# EAGLE schematic PXF_v2.0 (EAGLE 7.1.0)

## Sheet 1 of 9
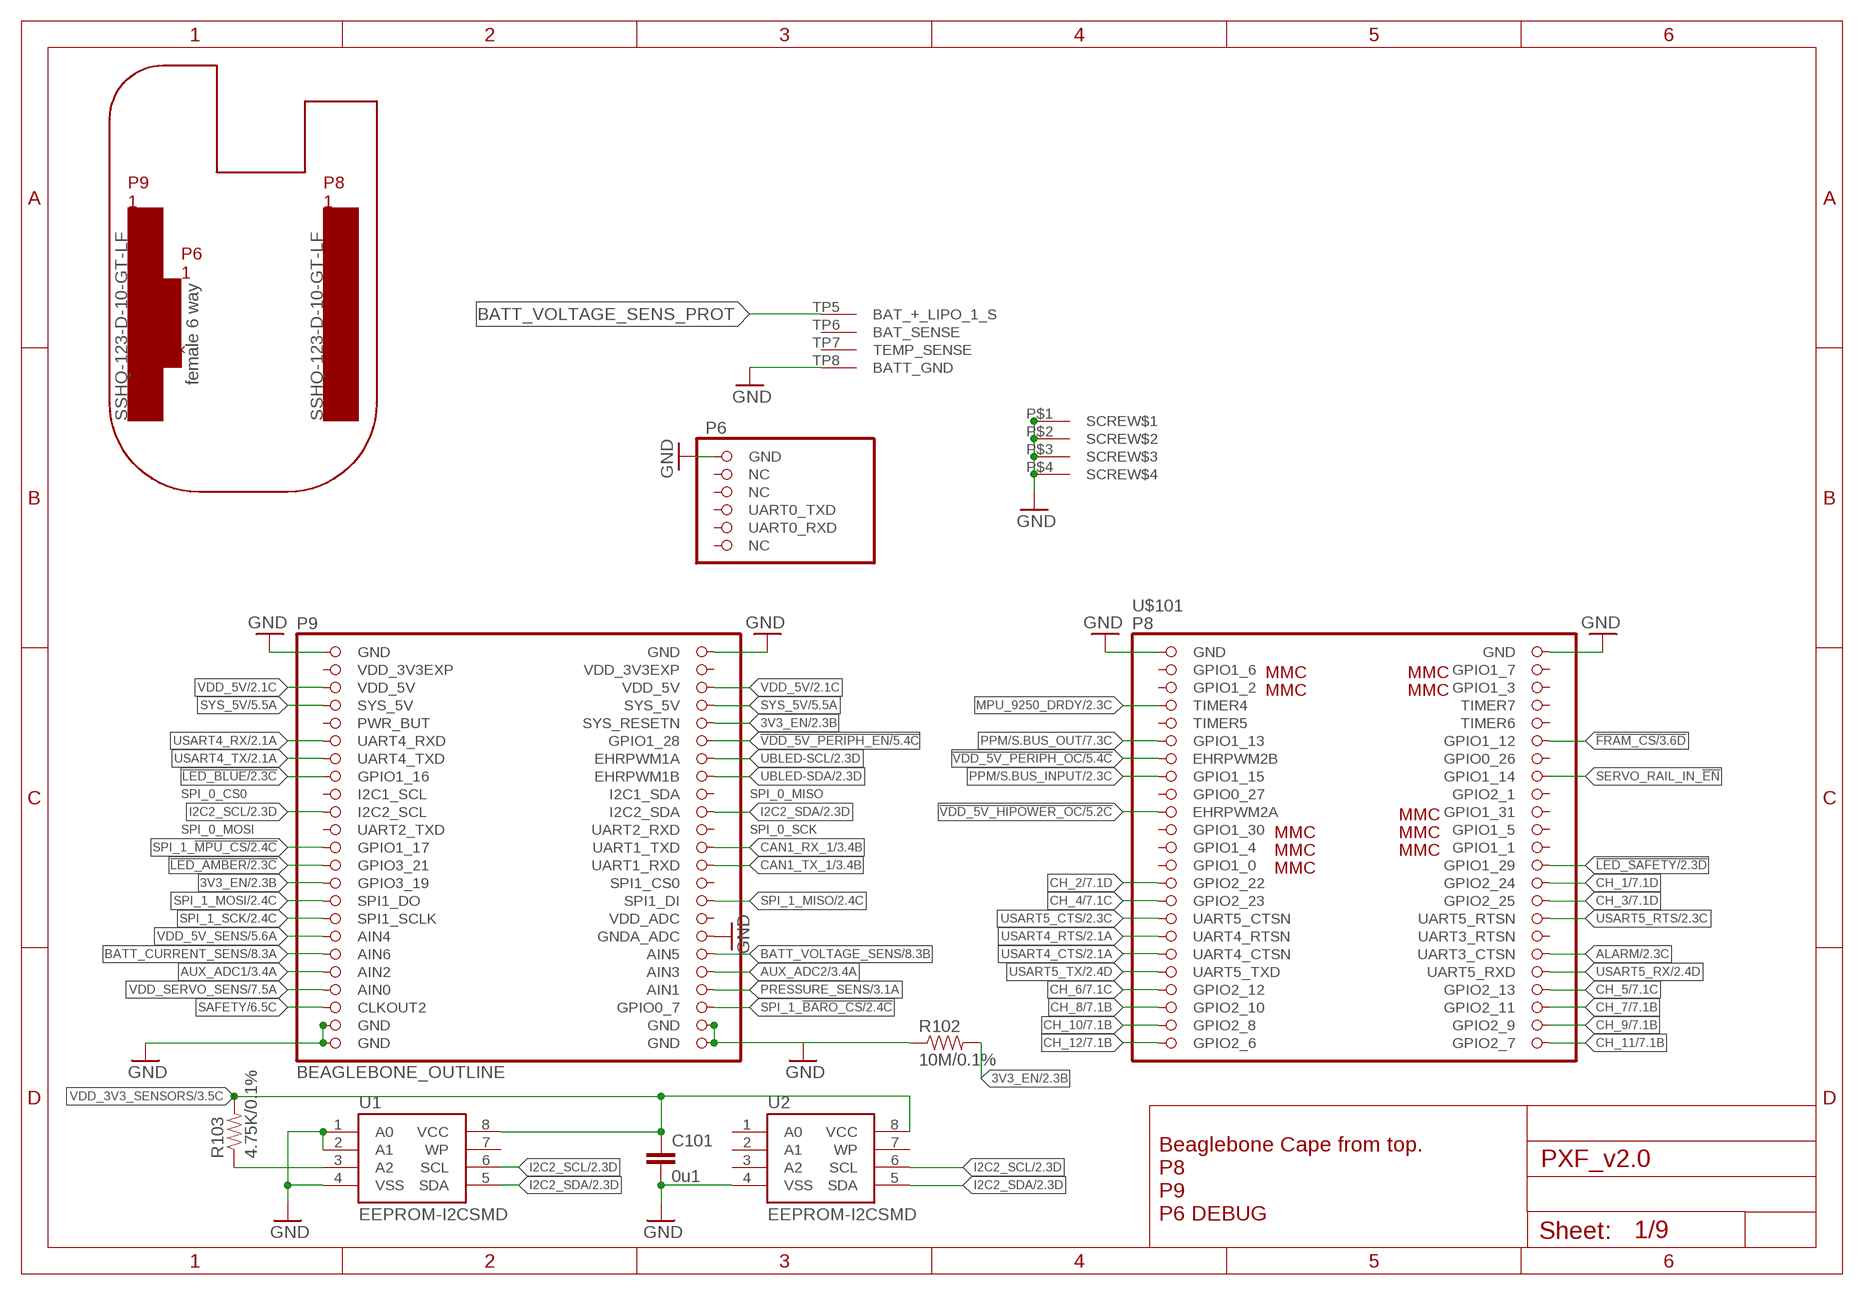
[diagram p0: schematic, sheet 1]
U$16 (NOT-CONNECTED): PARTNO: SSHQ-123-D-10-GT-LF
U$17 (NOT-CONNECTED): PARTNO: SSHQ-123-D-10-GT-LF
U$18 (NOT-CONNECTED): PARTNO: female 6 way

### Parts
C101  0u1  CAP0402  [0402-CAP]
R102  10M/0.1%  RESISTOR0402-RES  [0402-RES]
R103  4.75K/0.1%  RESISTOR0402-RES  [0402-RES]
U1  EEPROM-I2CSMD  [SO08]
U2  EEPROM-I2CSMD  [SO08]
U$101  BEAGLEBONE_OUTLINE  [BEAGLEBONE_SHIELD]

### Nets
3V3_EN [power]: R102.P$2 U$101.56(SYS_RESETN) U$101.73(GPIO3_19) ; also sheet 2,5
!FRAM_CS: U$101.12(GPIO1_12) ; also sheet 3
!LED_AMBER: U$101.71(GPIO3_21) ; also sheet 2,6
!LED_BLUE: U$101.61(GPIO1_16) ; also sheet 2,6
!LED_SAFETY: U$101.26(GPIO1_29) ; also sheet 2,6
!VDD_5V_HIPOWER_OC: U$101.19(EHRPWM2A) ; also sheet 5
!VDD_5V_PERIPH_EN: U$101.58(GPIO1_28) ; also sheet 5
!VDD_5V_PERIPH_OC: U$101.13(EHRPWM2B) ; also sheet 5
ALARM: U$101.36(UART3_CTSN) ; also sheet 2,6
AUX_ADC1: U$101.83(AIN2) ; also sheet 3,4
AUX_ADC2: U$101.84(AIN3) ; also sheet 3,4
BATT_CURRENT_SENS: U$101.81(AIN6) ; also sheet 8
BATT_VOLTAGE_SENS: U$101.82(AIN5) ; also sheet 8
BATT_VOLTAGE_SENS_PROT: U$101.TP5(BAT_+_LIPO_1_S) ; also sheet 8
CAN1_RX_1: U$101.70(UART1_TXD) ; also sheet 3
CAN1_TX_1: U$101.72(UART1_RXD) ; also sheet 3
CH_1: U$101.28(GPIO2_24) ; also sheet 7
CH_2: U$101.27(GPIO2_22) ; also sheet 7
CH_3: U$101.30(GPIO2_25) ; also sheet 7
CH_4: U$101.29(GPIO2_23) ; also sheet 7
CH_5: U$101.40(GPIO2_13) ; also sheet 7
CH_6: U$101.39(GPIO2_12) ; also sheet 7
CH_7: U$101.42(GPIO2_11) ; also sheet 7
CH_8: U$101.41(GPIO2_10) ; also sheet 7
CH_9: U$101.44(GPIO2_9) ; also sheet 7
CH_10: U$101.43(GPIO2_8) ; also sheet 7
CH_11: U$101.46(GPIO2_7) ; also sheet 7
CH_12: U$101.45(GPIO2_6) ; also sheet 7
GND [power]: C101.P$2 R102.P$1 U1.1(A0) U1.2(A1) U1.4(VSS) U2.4(VSS) U$101.1(GND) U$101.2(GND) U$101.47(GND) U$101.48(GND) U$101.80(GNDA_ADC) U$101.89(GND) U$101.90(GND) U$101.91(GND) U$101.92(GND) U$101.93(GND) U$101.P$1(SCREW$1) U$101.P$2(SCREW$2) U$101.P$3(SCREW$3) U$101.P$4(SCREW$4) U$101.TP8(BATT_GND) ; also sheet 2,3,4,5,6,7,8,9
I2C2_SCL: U1.6(SCL) U2.6(SCL) U$101.65(I2C2_SCL) ; also sheet 2,3,4,7
I2C2_SDA: U1.5(SDA) U2.5(SDA) U$101.66(I2C2_SDA) ; also sheet 2,3,4,7
MPU_9250_DRDY: U$101.7(TIMER4) ; also sheet 2,4
N$43: R103.P$1 U1.3(A2)
PPM/S.BUS_INPUT: U$101.15(GPIO1_15) ; also sheet 2,7,9
PPM/S.BUS_OUT: U$101.11(GPIO1_13) ; also sheet 7
PRESSURE_SENS: U$101.86(AIN1) ; also sheet 3
SAFETY: U$101.87(CLKOUT2) ; also sheet 6
SERVO_RAIL_IN_!EN: U$101.16(GPIO1_14)
SPI_1_!BARO_CS: U$101.88(GPIO0_7) ; also sheet 2,4
SPI_1_!MPU_CS: U$101.69(GPIO1_17) ; also sheet 2,4
SPI_1_MISO: U$101.76(SPI1_DI) ; also sheet 2,3,4
SPI_1_MOSI: U$101.75(SPI1_DO) ; also sheet 2,3,4
SPI_1_SCK: U$101.77(SPI1_SCLK) ; also sheet 2,3,4
SYS_5V: U$101.53(SYS_5V) U$101.54(SYS_5V) ; also sheet 5,7,8,9
UBLED-SCL: U$101.60(EHRPWM1A) ; also sheet 2,3
UBLED-SDA: U$101.62(EHRPWM1B) ; also sheet 2,3
USART4_CTS: U$101.35(UART4_CTSN) ; also sheet 2
USART4_RTS: U$101.33(UART4_RTSN) ; also sheet 2
USART4_RX: U$101.57(UART4_RXD) ; also sheet 2
USART4_TX: U$101.59(UART4_TXD) ; also sheet 2
USART5_CTS: U$101.31(UART5_CTSN) ; also sheet 2
USART5_RTS: U$101.32(UART5_RTSN) ; also sheet 2
USART5_RX: U$101.38(UART5_RXD) ; also sheet 2
USART5_TX: U$101.37(UART5_TXD) ; also sheet 2
VDD_3V3_SENSORS [power]: C101.P$1 R103.P$2 U1.8(VCC) U2.8(VCC) ; also sheet 3,4,5,9
VDD_5V [power]: U$101.51(VDD_5V) U$101.52(VDD_5V) ; also sheet 2,8,9
VDD_5V_SENS: U$101.79(AIN4) ; also sheet 5
VDD_SERVO_SENS: U$101.85(AIN0) ; also sheet 7
Unconnected: U1.7(WP) U2.1(A0) U2.2(A1) U2.3(A2) U2.7(WP) U$101.3(GPIO1_6) U$101.4(GPIO1_7) U$101.5(GPIO1_2) U$101.6(GPIO1_3) U$101.8(TIMER7) U$101.9(TIMER5) U$101.10(TIMER6) U$101.14(GPIO0_26) U$101.17(GPIO0_27) U$101.18(GPIO2_1) U$101.20(GPIO1_31) U$101.21(GPIO1_30) U$101.22(GPIO1_5) U$101.23(GPIO1_4) U$101.24(GPIO1_1) U$101.25(GPIO1_0) U$101.34(UART3_RTSN) U$101.55(PWR_BUT) U$101.63(I2C1_SCL) U$101.64(I2C1_SDA) U$101.67(UART2_TXD) U$101.68(UART2_RXD) U$101.74(SPI1_CS0) U$101.78(VDD_ADC) U$101.94(NC) U$101.95(NC) U$101.96(UART0_TXD) U$101.97(UART0_RXD) U$101.98(NC) U$101.TP6(BAT_SENSE) U$101.TP7(TEMP_SENSE)

### Notes on the sheet
- SPI_0_CS0 | SPI_0_MISO
- SPI_0_MOSI | SPI_0_SCK
- Beaglebone Cape from top.
  P8
  P9
  P6 DEBUG

## Sheet 2 of 9
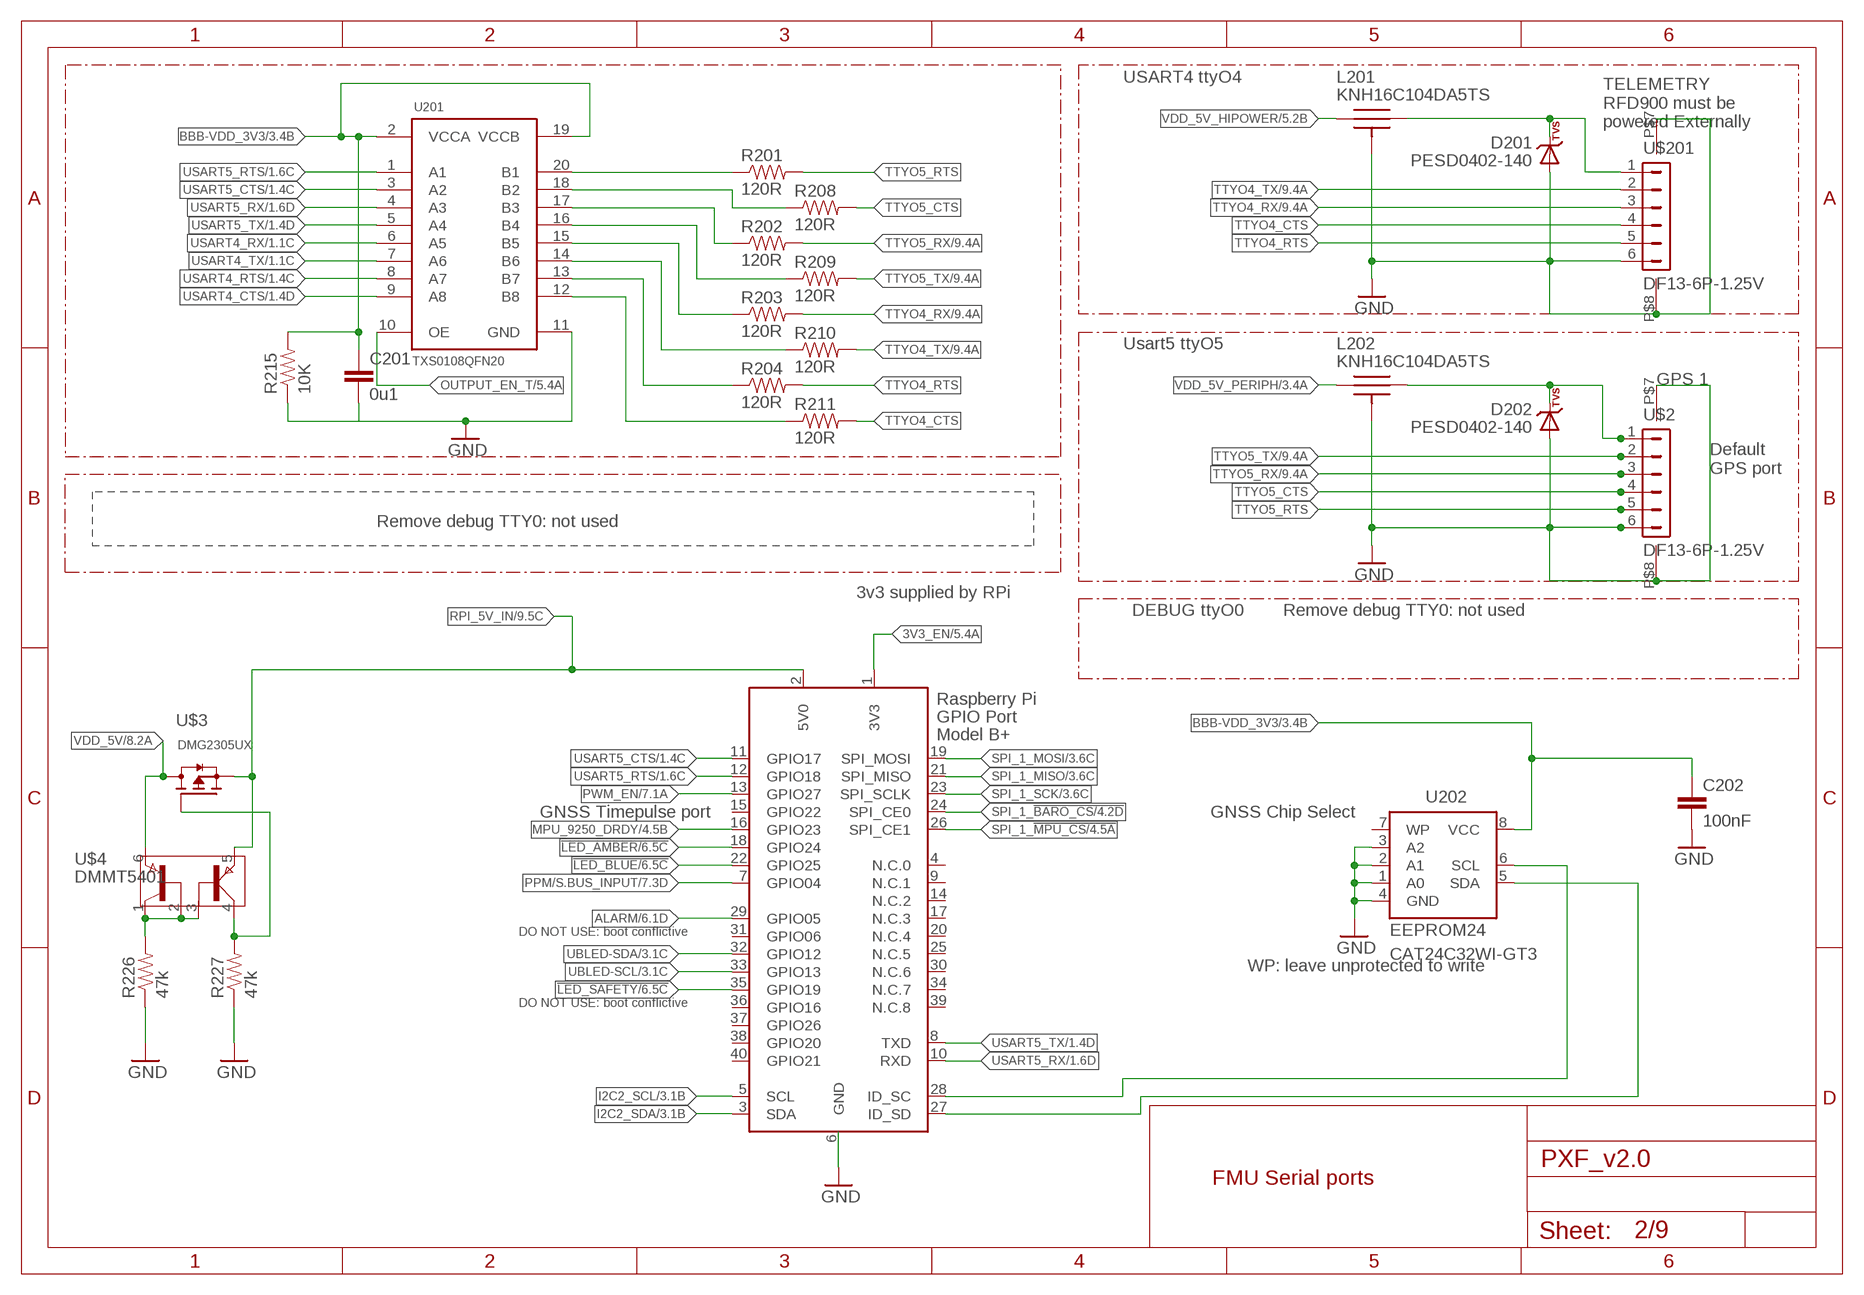
[diagram p1: schematic, sheet 2]

### Parts
C201  0u1  CAP0402  [0402-CAP]
C202  100nF  CAP0402  [0402-CAP]
D201  PESD0402-140  DIODE-TVS  [0402-TVS]
D202  PESD0402-140  DIODE-TVS  [0402-TVS]
L201  KNH16C104DA5TS  [KYOCERA-KNH16-DA]
L202  KNH16C104DA5TS  [KYOCERA-KNH16-DA]
R201  120R  RESISTOR0402-RES  [0402-RES]
R202  120R  RESISTOR0402-RES  [0402-RES]
R203  120R  RESISTOR0402-RES  [0402-RES]
R204  120R  RESISTOR0402-RES  [0402-RES]
R208  120R  RESISTOR0402-RES  [0402-RES]
R209  120R  RESISTOR0402-RES  [0402-RES]
R210  120R  RESISTOR0402-RES  [0402-RES]
R211  120R  RESISTOR0402-RES  [0402-RES]
R215  10K  RESISTOR0402-RES  [0402-RES]
R226  47k  RESISTOR0402-RES  [0402-RES]
R227  47k  RESISTOR0402-RES  [0402-RES]
U201  TXS0108QFN20  [QFN20-RGY]
U202  EEPROM24  [SOIC8]
U$2  DF13-6P-1.25V  [DF13C-6P-1.25V]
U$3  P-MOSFET  [SOT23]
U$4  DMMT5401  [SOT26]
U$201  DF13-6P-1.25V  [DF13C-6P-1.25V]
X2  RASPI_BOARD_B+_F  [RASPI_BOARD_B+_FULL]

### Nets
3V3_EN [power]: X2.1(3V3) ; also sheet 1,5
!LED_AMBER: X2.18(GPIO24) ; also sheet 1,6
!LED_BLUE: X2.22(GPIO25) ; also sheet 1,6
!LED_SAFETY: X2.35(GPIO19) ; also sheet 1,6
ALARM: X2.29(GPIO05) ; also sheet 1,6
BBB-VDD_3V3 [power]: C201.P$1 C202.P$1 R215.P$2 U201.2(VCCA) U201.19(VCCB) U202.8(VCC) ; also sheet 3,5,6,7,9
GND [power]: C201.P$2 C202.P$2 D201.A D202.A L201.P$3 L201.P$4 L201.P$5 L202.P$3 L202.P$4 L202.P$5 R215.P$1 R226.P$1 R227.P$1 U201.11(GND) U202.1(A0) U202.2(A1) U202.3(A2) U202.4(GND) U$2.6 U$2.P$7 U$2.P$8 U$201.6 U$201.P$7 U$201.P$8 ; also sheet 1,3,4,5,6,7,8,9
I2C2_SCL: X2.5(SCL) ; also sheet 1,3,4,7
I2C2_SDA: X2.3(SDA) ; also sheet 1,3,4,7
MPU_9250_DRDY: X2.16(GPIO23) ; also sheet 1,4
N$1: U202.6(SCL) X2.28(ID_SC)
N$3: U202.5(SDA) X2.27(ID_SD)
N$5 [power]: D201.C L201.P$2 U$201.1
N$7: R226.P$2 U$4.1 U$4.2 U$4.3
N$8: R227.P$2 U$3.G U$4.4
N$49: R208.P$1 U201.18(B2)
N$53: R201.P$1 U201.20(B1)
N$83: R202.P$1 U201.17(B3)
N$84: R209.P$1 U201.16(B4)
N$85: R203.P$1 U201.15(B5)
N$86: R210.P$1 U201.14(B6)
N$87: R204.P$1 U201.13(B7)
N$88: R211.P$1 U201.12(B8)
N$101 [power]: D202.C L202.P$2 U$2.1
OUTPUT_EN_T: U201.10(OE) ; also sheet 5
PPM/S.BUS_INPUT: X2.7(GPIO04) ; also sheet 1,7,9
PWM_EN: X2.13(GPIO27) ; also sheet 7,9
RPI_5V_IN: U$3.S U$4.5 X2.2(5V0) ; also sheet 9
SPI_1_!BARO_CS: X2.24(SPI_CE0) ; also sheet 1,4
SPI_1_!MPU_CS: X2.26(SPI_CE1) ; also sheet 1,4
SPI_1_MISO: X2.21(SPI_MISO) ; also sheet 1,3,4
SPI_1_MOSI: X2.19(SPI_MOSI) ; also sheet 1,3,4
SPI_1_SCK: X2.23(SPI_SCLK) ; also sheet 1,3,4
TTYO4_CTS: R211.P$2 U$201.4
TTYO4_RTS: R204.P$2 U$201.5
TTYO4_RX: R203.P$2 U$201.3 ; also sheet 9
TTYO4_TX: R210.P$2 U$201.2 ; also sheet 9
TTYO5_CTS: R208.P$2 U$2.4
TTYO5_RTS: R201.P$2 U$2.5
TTYO5_RX: R202.P$2 U$2.3 ; also sheet 9
TTYO5_TX: R209.P$2 U$2.2 ; also sheet 9
UBLED-SCL: X2.33(GPIO13) ; also sheet 1,3
UBLED-SDA: X2.32(GPIO12) ; also sheet 1,3
USART4_CTS: U201.9(A8) ; also sheet 1
USART4_RTS: U201.8(A7) ; also sheet 1
USART4_RX: U201.6(A5) ; also sheet 1
USART4_TX: U201.7(A6) ; also sheet 1
USART5_CTS: U201.3(A2) X2.11(GPIO17) ; also sheet 1
USART5_RTS: U201.1(A1) X2.12(GPIO18) ; also sheet 1
USART5_RX: U201.4(A3) X2.10(RXD) ; also sheet 1
USART5_TX: U201.5(A4) X2.8(TXD) ; also sheet 1
VDD_5V [power]: U$3.D U$4.6 ; also sheet 1,8,9
VDD_5V_HIPOWER [power]: L201.P$1 ; also sheet 5
VDD_5V_PERIPH [power]: L202.P$1 ; also sheet 3,5,6
Unconnected: U202.7(WP) X2.4(N.C.0) X2.9(N.C.1) X2.14(N.C.2) X2.15(GPIO22) X2.17(N.C.3) X2.20(N.C.4) X2.25(N.C.5) X2.30(N.C.6) X2.31(GPIO06) X2.34(N.C.7) X2.36(GPIO16) X2.37(GPIO26) X2.38(GPIO20) X2.39(N.C.8) X2.40(GPIO21)

### Notes on the sheet
- USART4 ttyO4
- TELEMETRY
  RFD900 must be
  powered Externally
- Usart5 ttyO5
- GPS 1
- Default 
  GPS port
- Remove debug TTY0: not used
- 3v3 supplied by RPi
- DEBUG ttyO0 | Remove debug TTY0: not used
- GNSS Timepulse port | GNSS Chip Select
- DO NOT USE: boot conflictive
- CAT24C32WI-GT3
- WP: leave unprotected to write
- DO NOT USE: boot conflictive
- FMU Serial ports

## Sheet 3 of 9
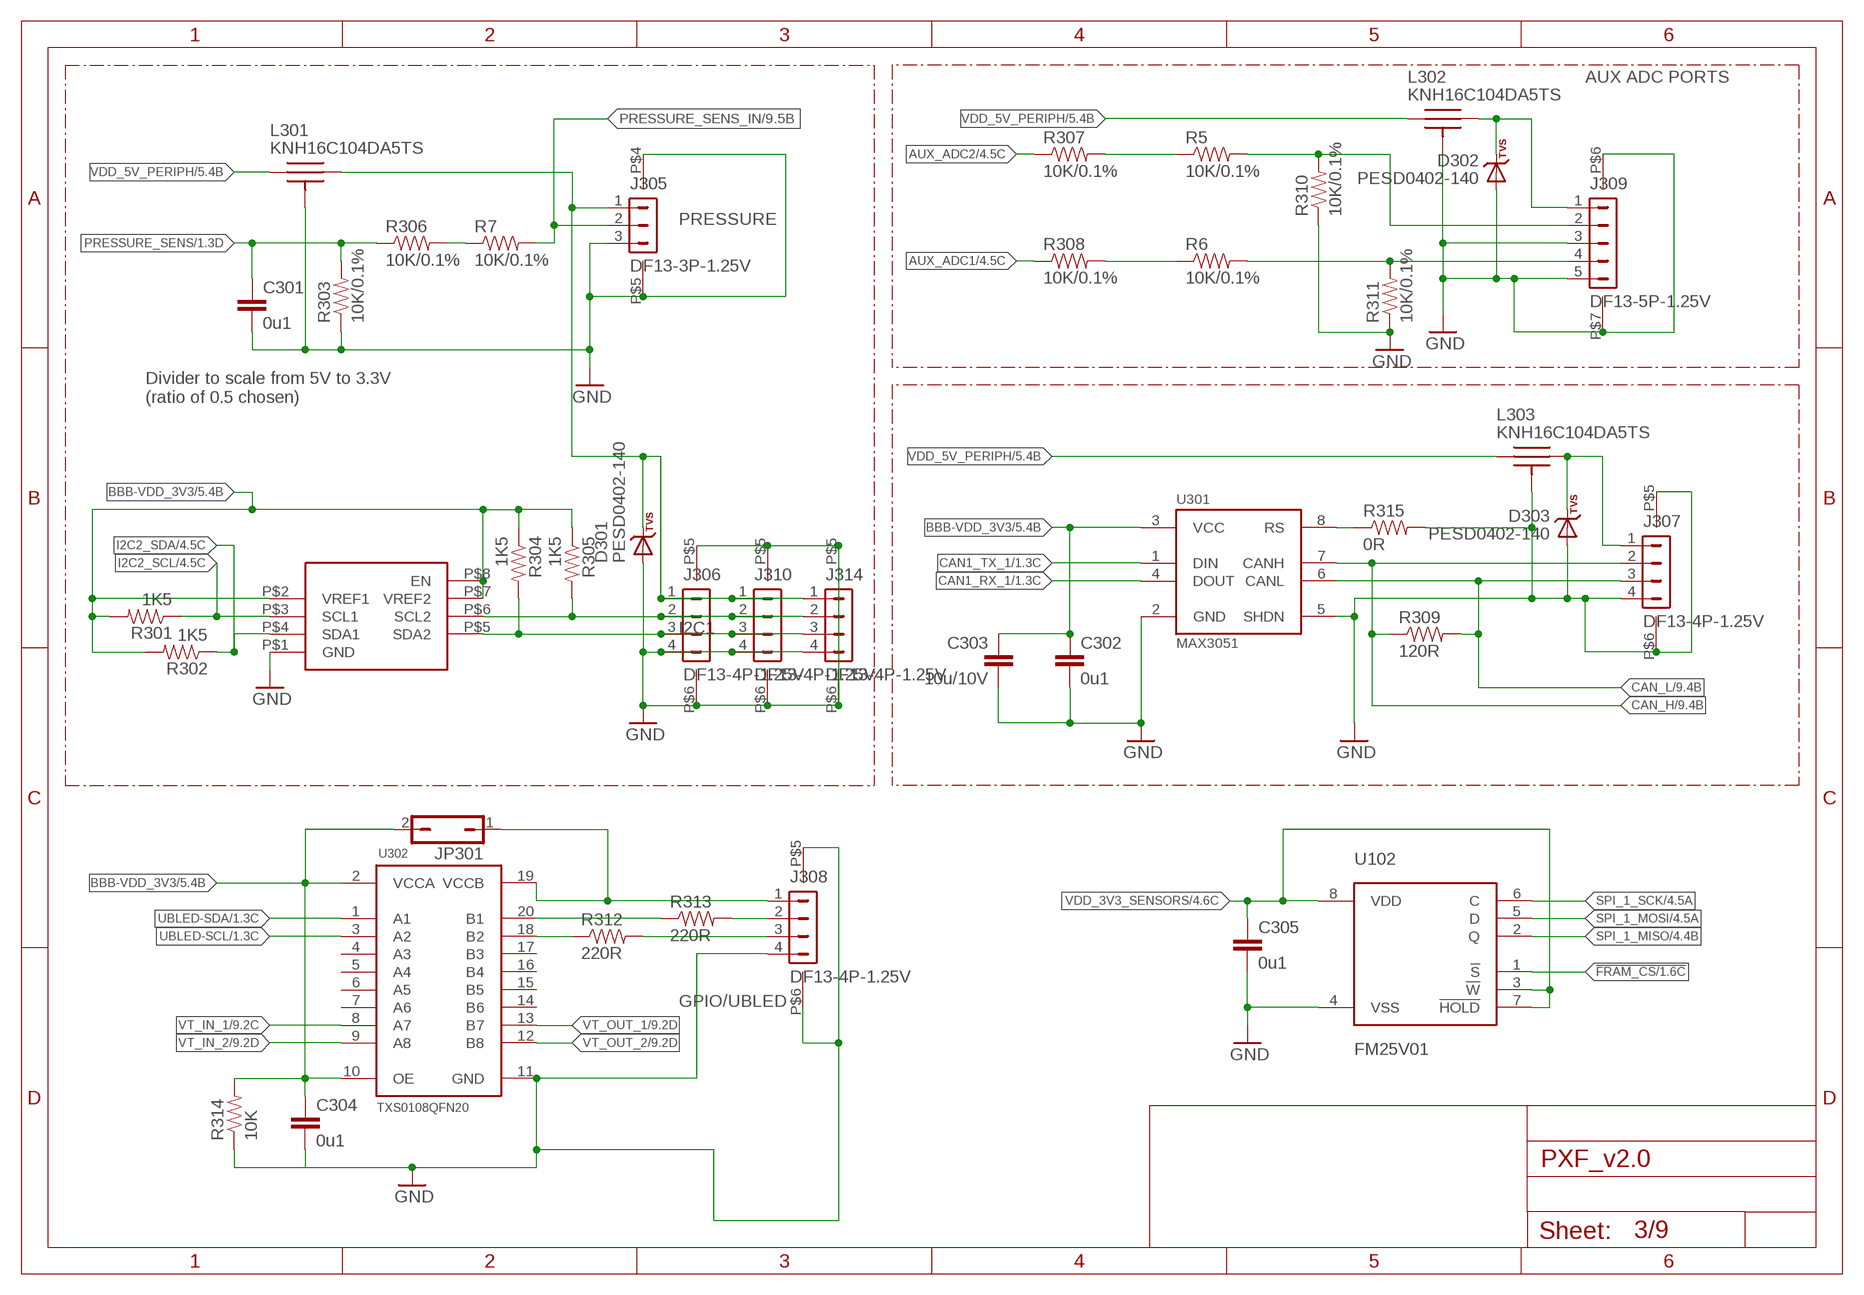
[diagram p2: schematic, sheet 3]

### Parts
C301  0u1  CAP0402  [0402-CAP]
C302  0u1  CAP0402  [0402-CAP]
C303  10u/10V  CAP0805  [0805-CAP]
C304  0u1  CAP0402  [0402-CAP]
C305  0u1  CAP0402  [0402-CAP]
D301  PESD0402-140  DIODE-TVS  [0402-TVS]
D302  PESD0402-140  DIODE-TVS  [0402-TVS]
D303  PESD0402-140  DIODE-TVS  [0402-TVS]
J305  DF13-3P-1.25V  [DF13C-3P-1.25V]
J306  DF13-4P-1.25V  [DF13C-4P-1.25V]
J307  DF13-4P-1.25V  [DF13C-4P-1.25V]
J308  DF13-4P-1.25V  [DF13C-4P-1.25V]
J309  DF13-5P-1.25V  [DF13C-5P-1.25V]
J310  DF13-4P-1.25V  [DF13C-4P-1.25V]
J314  DF13-4P-1.25V  [DF13C-4P-1.25V]
JP301  JP1Q  [JP1]
L301  KNH16C104DA5TS  [KYOCERA-KNH16-DA]
L302  KNH16C104DA5TS  [KYOCERA-KNH16-DA]
L303  KNH16C104DA5TS  [KYOCERA-KNH16-DA]
R5  10K/0.1%  RESISTOR0402-RES  [0402-RES]
R6  10K/0.1%  RESISTOR0402-RES  [0402-RES]
R7  10K/0.1%  RESISTOR0402-RES  [0402-RES]
R301  1K5  RESISTOR0402-RES  [0402-RES]
R302  1K5  RESISTOR0402-RES  [0402-RES]
R303  10K/0.1%  RESISTOR0402-RES  [0402-RES]
R304  1K5  RESISTOR0402-RES  [0402-RES]
R305  1K5  RESISTOR0402-RES  [0402-RES]
R306  10K/0.1%  RESISTOR0402-RES  [0402-RES]
R307  10K/0.1%  RESISTOR0402-RES  [0402-RES]
R308  10K/0.1%  RESISTOR0402-RES  [0402-RES]
R309  120R  RESISTOR0402-RES  [0402-RES]
R310  10K/0.1%  RESISTOR0402-RES  [0402-RES]
R311  10K/0.1%  RESISTOR0402-RES  [0402-RES]
R312  220R  RESISTOR0402-RES  [0402-RES]
R313  220R  RESISTOR0402-RES  [0402-RES]
R314  10K  RESISTOR0402-RES  [0402-RES]
R315  0R  RESISTOR0402-RES  [0402-RES]
U102  FM25V01  [SO08]
U301  MAX3051  MAX3051MAX3051EKA  [SOT23-8]
U302  TXS0108QFN20  [QFN20-RGY]
U304  PCA9603  [DCT]

### Nets
!FRAM_CS: U102.1(!S) ; also sheet 1
AUX_ADC1: R308.P$1 ; also sheet 1,4
AUX_ADC2: R307.P$1 ; also sheet 1,4
BBB-VDD_3V3 [power]: C302.P$1 C303.P$1 C304.P$1 JP301.2 R301.P$2 R302.P$2 R304.P$1 R305.P$1 R314.P$2 U301.3(VCC) U302.2(VCCA) U302.10(OE) U304.P$2(VREF1) U304.P$7(VREF2) U304.P$8(EN) ; also sheet 2,5,6,7,9
CAN1_RX_1: U301.4(DOUT) ; also sheet 1
CAN1_TX_1: U301.1(DIN) ; also sheet 1
CAN_H: J307.2 R309.P$1 U301.7(CANH) ; also sheet 9
CAN_L: J307.3 R309.P$2 U301.6(CANL) ; also sheet 9
FMU_AUX_ADC1_PROT: J309.4 R6.P$2 R311.P$2
FMU_AUX_ADC2_PROT: J309.2 R5.P$2 R310.P$2
GND [power]: C301.P$2 C302.P$2 C303.P$2 C304.P$2 C305.P$2 D301.A D302.A D303.A J305.3 J305.P$4 J305.P$5 J306.4 J306.P$5 J306.P$6 J307.4 J307.P$5 J307.P$6 J308.4 J308.P$5 J308.P$6 J309.3 J309.5 J309.P$6 J309.P$7 J310.4 J310.P$5 J310.P$6 J314.4 J314.P$5 J314.P$6 L301.P$3 L301.P$4 L301.P$5 L302.P$3 L302.P$4 L302.P$5 L303.P$3 L303.P$4 L303.P$5 R303.P$1 R310.P$1 R311.P$1 R314.P$1 R315.P$2 U102.4(VSS) U301.2(GND) U301.5(SHDN) U302.11(GND) U304.P$1(GND) ; also sheet 1,2,4,5,6,7,8,9
I2C2_SCL: R301.P$1 U304.P$3(SCL1) ; also sheet 1,2,4,7
I2C2_SDA: R302.P$1 U304.P$4(SDA1) ; also sheet 1,2,4,7
N$17: R313.P$1 U302.20(B1)
N$33: J306.2 J310.2 J314.2 R305.P$2 U304.P$6(SCL2)
N$37: J306.3 J310.3 J314.3 R304.P$2 U304.P$5(SDA2)
N$38: R312.P$1 U302.18(B2)
N$42 [power]: D301.C J305.1 J306.1 J310.1 J314.1 L301.P$2
N$44: J308.3 R312.P$2
N$45: J308.2 R313.P$2
N$47: J308.1 JP301.1 U302.19(VCCB)
N$48 [power]: D303.C J307.1 L303.P$2
N$55 [power]: R315.P$1 U301.8(RS)
N$64: R5.P$1 R307.P$2
N$65: R6.P$1 R308.P$2
N$66: R7.P$1 R306.P$2
N$98 [power]: D302.C J309.1 L302.P$2
PRESSURE_SENS: C301.P$1 R303.P$2 R306.P$1 ; also sheet 1
PRESSURE_SENS_IN: J305.2 R7.P$2 ; also sheet 9
SPI_1_MISO: U102.2(Q) ; also sheet 1,2,4
SPI_1_MOSI: U102.5(D) ; also sheet 1,2,4
SPI_1_SCK: U102.6(C) ; also sheet 1,2,4
UBLED-SCL: U302.3(A2) ; also sheet 1,2
UBLED-SDA: U302.1(A1) ; also sheet 1,2
VDD_3V3_SENSORS [power]: C305.P$1 U102.3(!W) U102.7(!HOLD) U102.8(VDD) ; also sheet 1,4,5,9
VDD_5V_PERIPH [power]: L301.P$1 L302.P$1 L303.P$1 ; also sheet 2,5,6
VT_IN_1: U302.8(A7) ; also sheet 9
VT_IN_2: U302.9(A8) ; also sheet 9
VT_OUT_1: U302.13(B7) ; also sheet 9
VT_OUT_2: U302.12(B8) ; also sheet 9
Unconnected: U302.4(A3) U302.5(A4) U302.6(A5) U302.7(A6) U302.14(B6) U302.15(B5) U302.16(B4) U302.17(B3)

### Notes on the sheet
- AUX ADC PORTS
- PRESSURE
- Divider to scale from 5V to 3.3V
  (ratio of 0.5 chosen)
- I2C1
- GPIO/UBLED

## Sheet 4 of 9
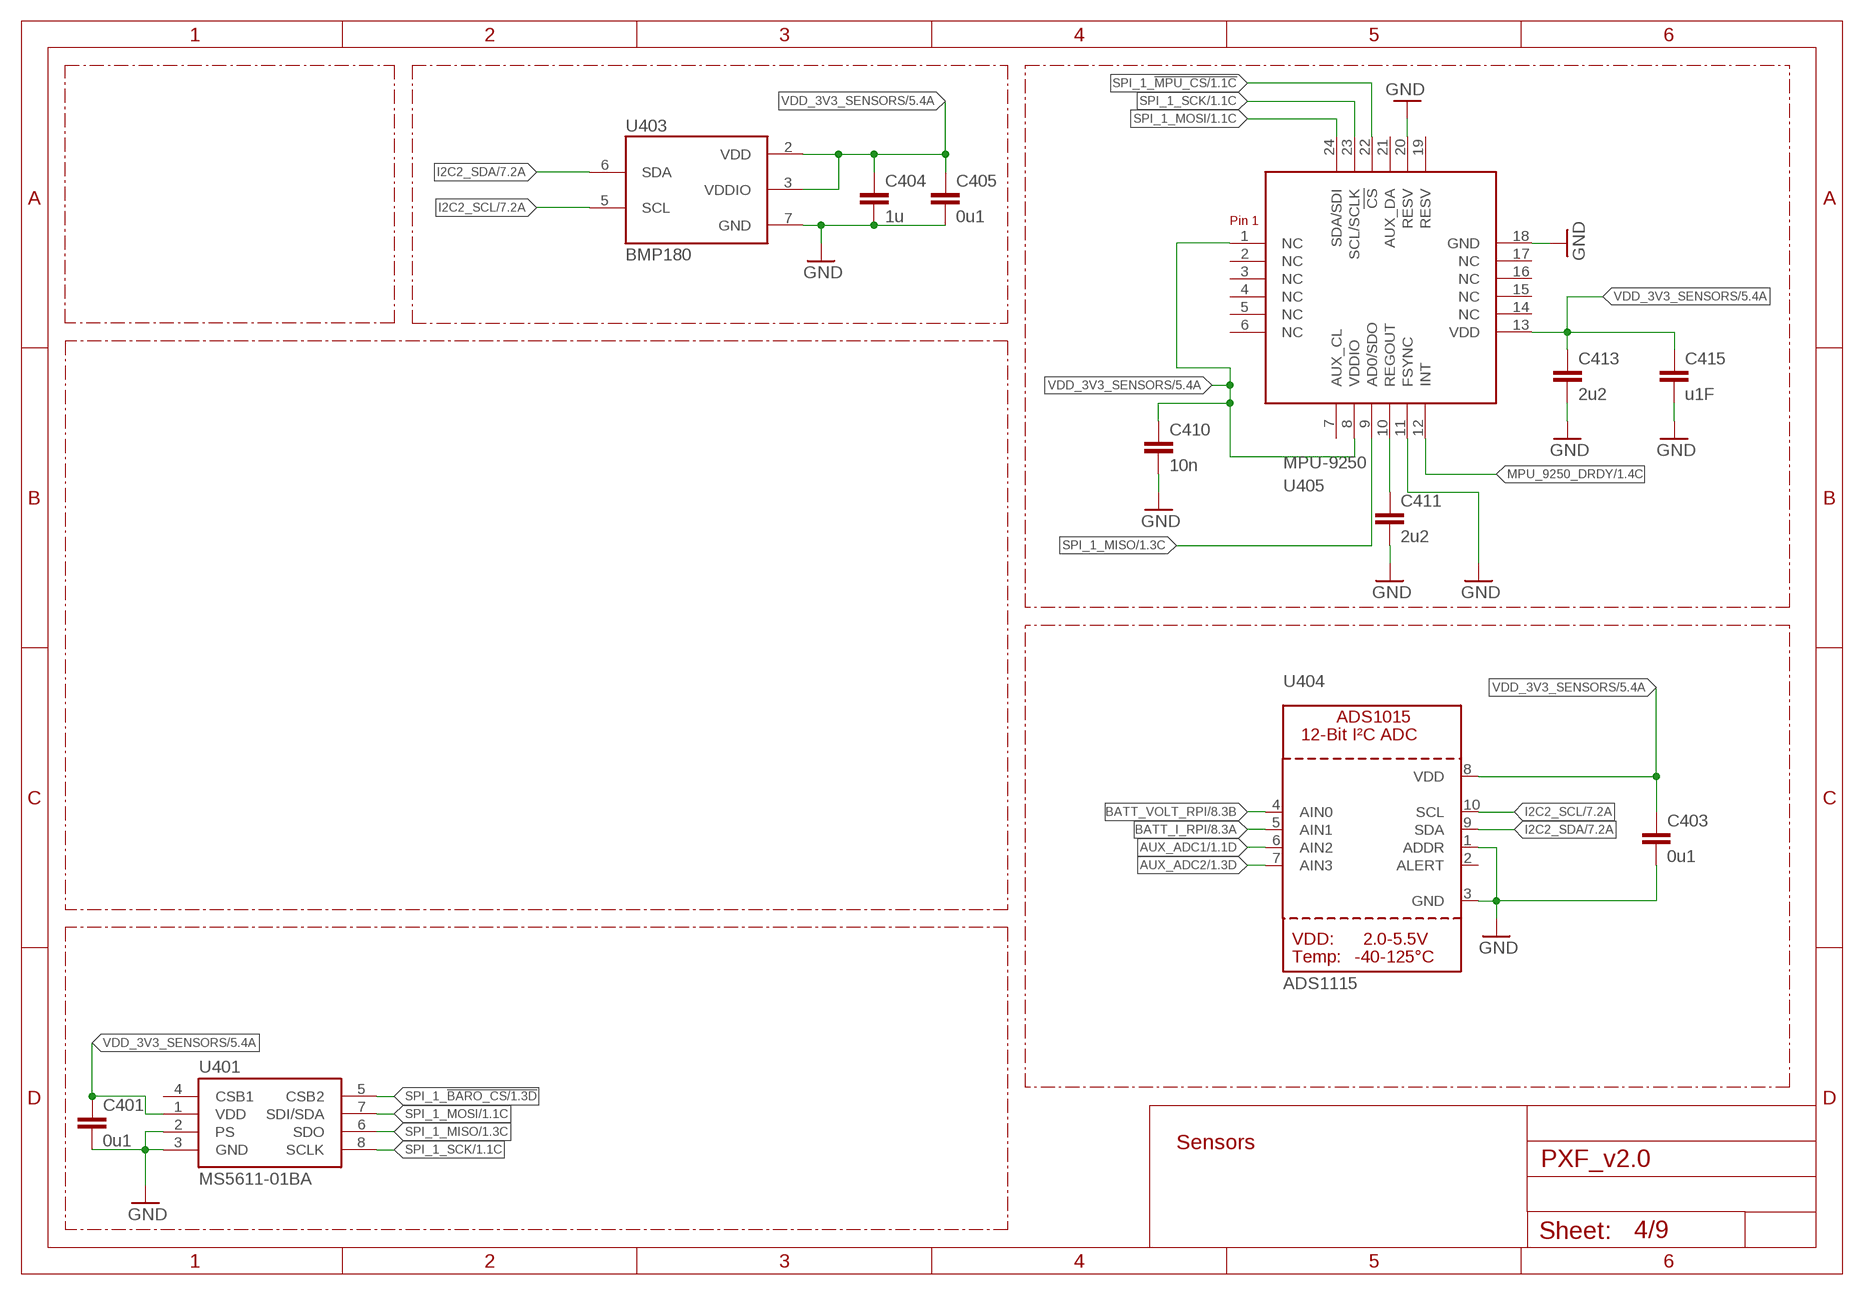
[diagram p3: schematic, sheet 4]

### Parts
C401  0u1  CAP0402  [0402-CAP]
C403  0u1  CAP0402  [0402-CAP]
C404  1u  CAP0402  [0402-CAP]
C405  0u1  CAP0402  [0402-CAP]
C410  10n  CAP0603  [0603-CAP]
C411  2u2  CAP0603  [0603-CAP]
C413  2u2  CAP0603  [0603-CAP]
C415  u1F  CAP0402  [0402-CAP]
U401  MS5611-01BA  [MS5611-01BA]
U403  BMP180  [BMP180]
U404  ADS1115  ADC_ADS1015  [MSOP10]
U405  MPU-9250  MPU-6500  [MPU-6500]

### Nets
AUX_ADC1: U404.6(AIN2) ; also sheet 1,3
AUX_ADC2: U404.7(AIN3) ; also sheet 1,3
BATT_I_RPI: U404.5(AIN1) ; also sheet 8,9
BATT_VOLT_RPI: U404.4(AIN0) ; also sheet 8,9
GND [power]: C401.P$2 C403.P$2 C404.P$2 C405.P$2 C410.P$2 C411.P$2 C413.P$2 C415.P$2 U401.2(PS) U401.3(GND) U403.7(GND) U404.1(ADDR) U404.3(GND) U405.11(FSYNC) U405.18(GND) U405.20(RESV) ; also sheet 1,2,3,5,6,7,8,9
I2C2_SCL: U403.5(SCL) U404.10(SCL) ; also sheet 1,2,3,7
I2C2_SDA: U403.6(SDA) U404.9(SDA) ; also sheet 1,2,3,7
MPU_9250_DRDY: U405.12(INT) ; also sheet 1,2
N$15: C411.P$1 U405.10(REGOUT)
SPI_1_!BARO_CS: U401.5(CSB2) ; also sheet 1,2
SPI_1_!MPU_CS: U405.22(!CS) ; also sheet 1,2
SPI_1_MISO: U401.6(SDO) U405.9(AD0/SDO) ; also sheet 1,2,3
SPI_1_MOSI: U401.7(SDI/SDA) U405.24(SDA/SDI) ; also sheet 1,2,3
SPI_1_SCK: U401.8(SCLK) U405.23(SCL/SCLK) ; also sheet 1,2,3
VDD_3V3_SENSORS [power]: C401.P$1 C403.P$1 C404.P$1 C405.P$1 C410.P$1 C413.P$1 C415.P$1 U401.1(VDD) U403.2(VDD) U403.3(VDDIO) U404.8(VDD) U405.1(NC) U405.8(VDDIO) U405.13(VDD) ; also sheet 1,3,5,9
Unconnected: U401.4(CSB1) U404.2(ALERT) U405.2(NC) U405.3(NC) U405.4(NC) U405.5(NC) U405.6(NC) U405.7(AUX_CL) U405.14(NC) U405.15(NC) U405.16(NC) U405.17(NC) U405.19(RESV) U405.21(AUX_DA)

### Notes on the sheet
- Sensors

## Sheet 5 of 9
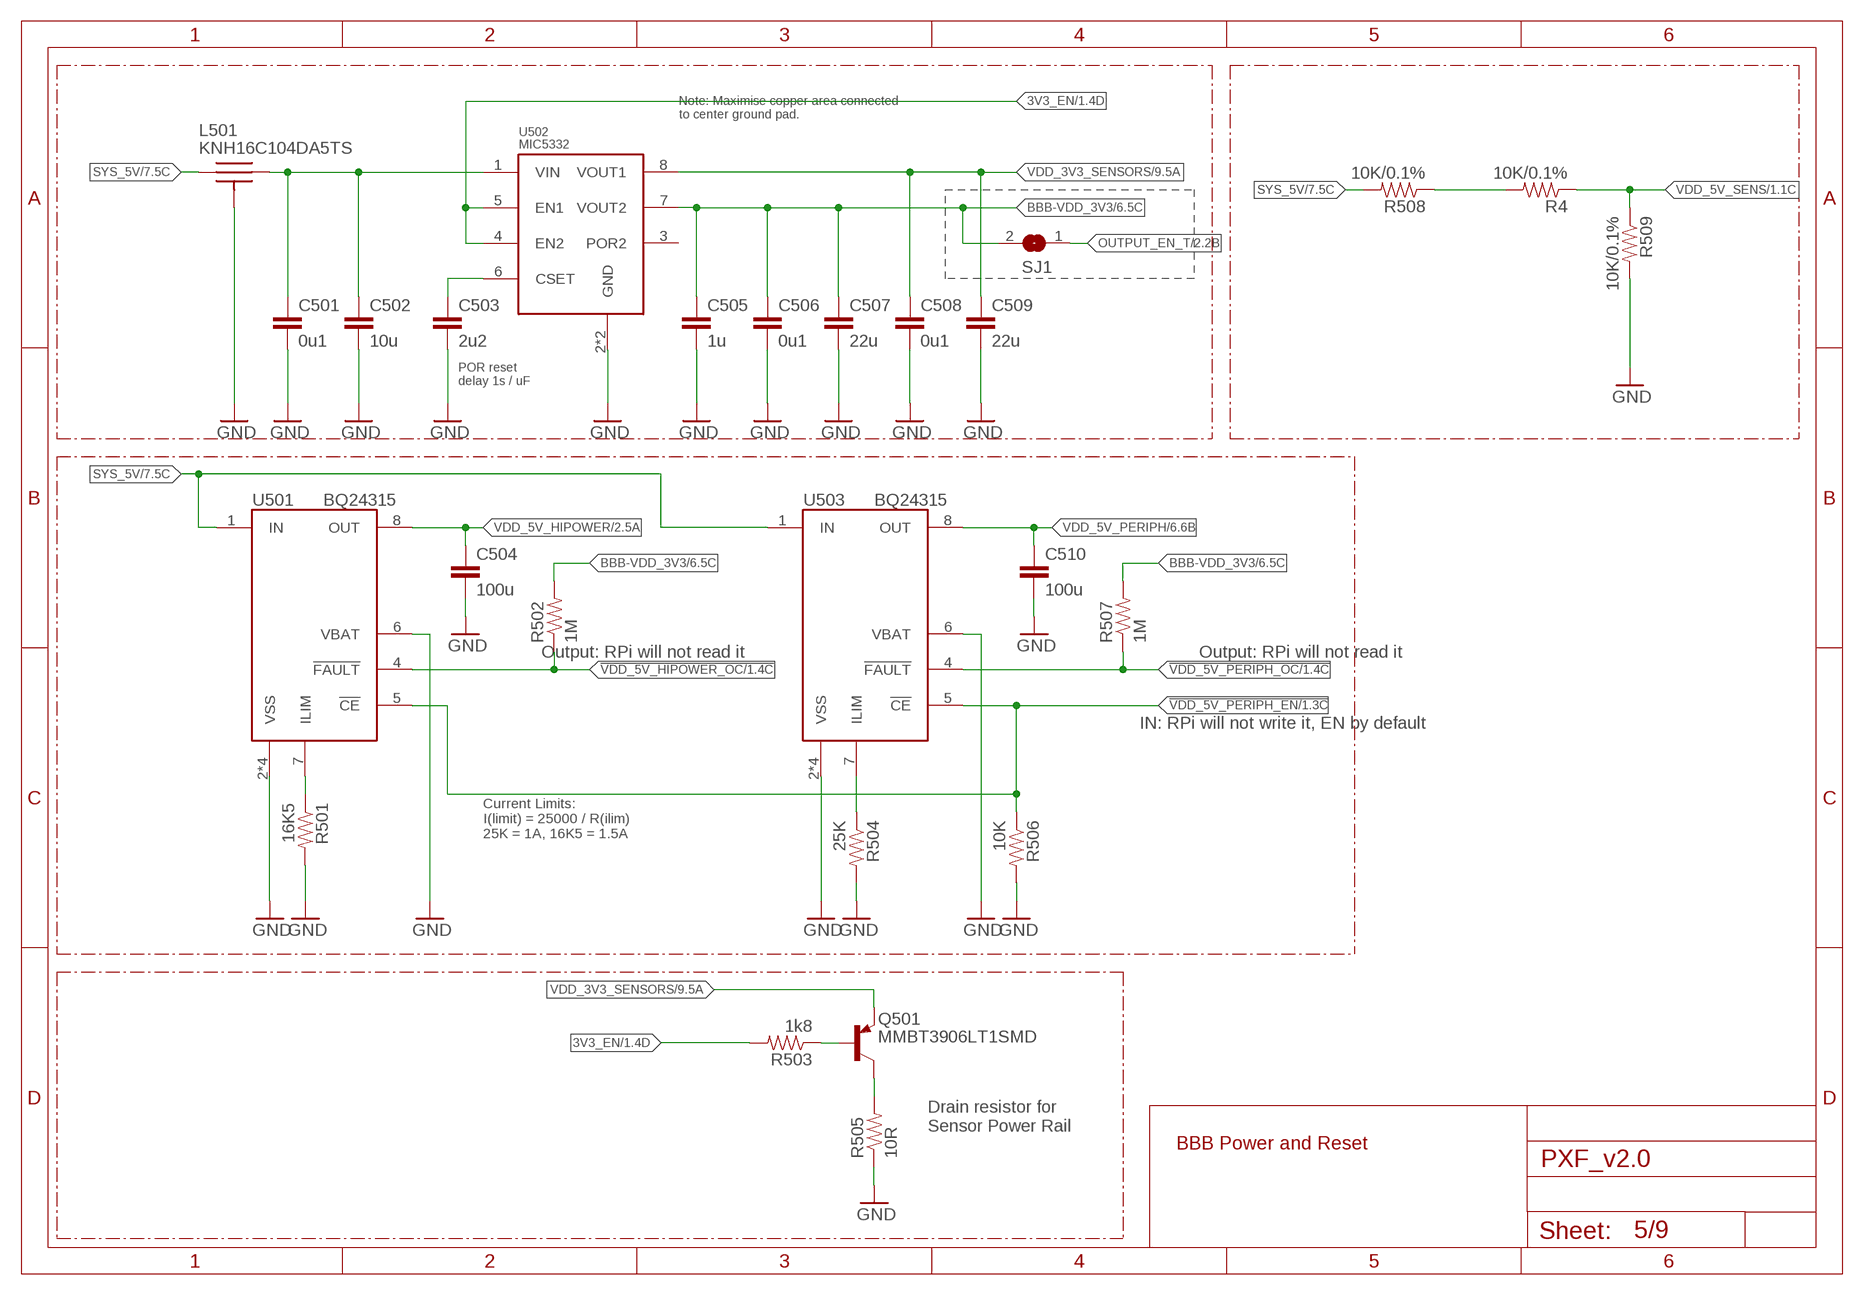
[diagram p4: schematic, sheet 5]

### Parts
C501  0u1  CAP0402  [0402-CAP]
C502  10u  CAP0805  [0805-CAP]
C503  2u2  CAP0603  [0603-CAP]
C504  100u  CAP1206  [1206-CAP]
C505  1u  CAP0603  [0603-CAP]
C506  0u1  CAP0402  [0402-CAP]
C507  22u  CAP0805  [0805-CAP]
C508  0u1  CAP0402  [0402-CAP]
C509  22u  CAP0805  [0805-CAP]
C510  100u  CAP1206  [1206-CAP]
L501  KNH16C104DA5TS  [KYOCERA-KNH16-DA]
Q501  MMBT3906LT1SMD  [SOT23-BEC]
R4  10K/0.1%  RESISTOR0402-RES  [0402-RES]
R501  16K5  RESISTOR0402-RES  [0402-RES]
R502  1M  RESISTOR0402-RES  [0402-RES]
R503  1k8  RESISTOR0402-RES  [0402-RES]
R504  25K  RESISTOR0402-RES  [0402-RES]
R505  10R  RESISTOR0603-RES  [0603-RES]
R506  10K  RESISTOR0402-RES  [0402-RES]
R507  1M  RESISTOR0402-RES  [0402-RES]
R508  10K/0.1%  RESISTOR0402-RES  [0402-RES]
R509  10K/0.1%  RESISTOR0402-RES  [0402-RES]
SJ1  SOLDERJUMPERCLOSED  [SOLDERJUMPER_CLOSEDWIRE]
U501  BQ24315  [QFN8-DSG]
U502  MIC5332  [MLF-8-EPAD]
U503  BQ24315  [QFN8-DSG]

### Nets
3V3_EN [power]: R503.P$2 U502.4(EN2) U502.5(EN1) ; also sheet 1,2
!VDD_5V_HIPOWER_OC: R502.P$1 U501.4(!FAULT) ; also sheet 1
!VDD_5V_PERIPH_EN: R506.P$1 U501.5(!CE) U503.5(!CE) ; also sheet 1
!VDD_5V_PERIPH_OC: R507.P$1 U503.4(!FAULT) ; also sheet 1
BBB-VDD_3V3 [power]: C505.P$1 C506.P$1 C507.P$1 R502.P$2 R507.P$2 SJ1.2 U502.7(VOUT2) ; also sheet 2,3,6,7,9
FMU-VDD_5V5 [power]: C501.P$1 C502.P$1 L501.P$2 U502.1(VIN)
GND [power]: C501.P$2 C502.P$2 C503.P$2 C504.P$2 C505.P$2 C506.P$2 C507.P$2 C508.P$2 C509.P$2 C510.P$2 L501.P$3 L501.P$4 L501.P$5 R501.P$2 R504.P$2 R505.1 R506.P$2 R509.P$2 U501.2(VSS) U501.6(VBAT) U501.GND(VSS) U501.P$2(VSS) U501.P$3(VSS) U502.2(GND) U502.GND U503.2(VSS) U503.6(VBAT) U503.GND(VSS) U503.P$2(VSS) U503.P$3(VSS) ; also sheet 1,2,3,4,6,7,8,9
N$11: C503.P$1 U502.6(CSET)
N$34: R504.P$1 U503.7(ILIM)
N$62: R4.P$2 R508.P$1
N$80: Q501.C R505.2
N$81: Q501.B R503.P$1
N$96: R501.P$1 U501.7(ILIM)
OUTPUT_EN_T: SJ1.1 ; also sheet 2
SYS_5V: L501.P$1 R508.P$2 U501.1(IN) U503.1(IN) ; also sheet 1,7,8,9
VDD_3V3_SENSORS [power]: C508.P$1 C509.P$1 Q501.E U502.8(VOUT1) ; also sheet 1,3,4,9
VDD_5V_HIPOWER [power]: C504.P$1 U501.8(OUT) ; also sheet 2
VDD_5V_PERIPH [power]: C510.P$1 U503.8(OUT) ; also sheet 2,3,6
VDD_5V_SENS: R4.P$1 R509.P$1 ; also sheet 1
Unconnected: U502.3(POR2)

### Notes on the sheet
- Note: Maximise copper area connected 
  to center ground pad.
- POR reset 
  delay 1s / uF
- Output: RPi will not read it | Output: RPi will not read it
- IN: RPi will not write it, EN by default
- Current Limits:
  I(limit) = 25000 / R(ilim)
  25K = 1A, 16K5 = 1.5A
- Drain resistor for 
  Sensor Power Rail
- BBB Power and Reset

## Sheet 6 of 9
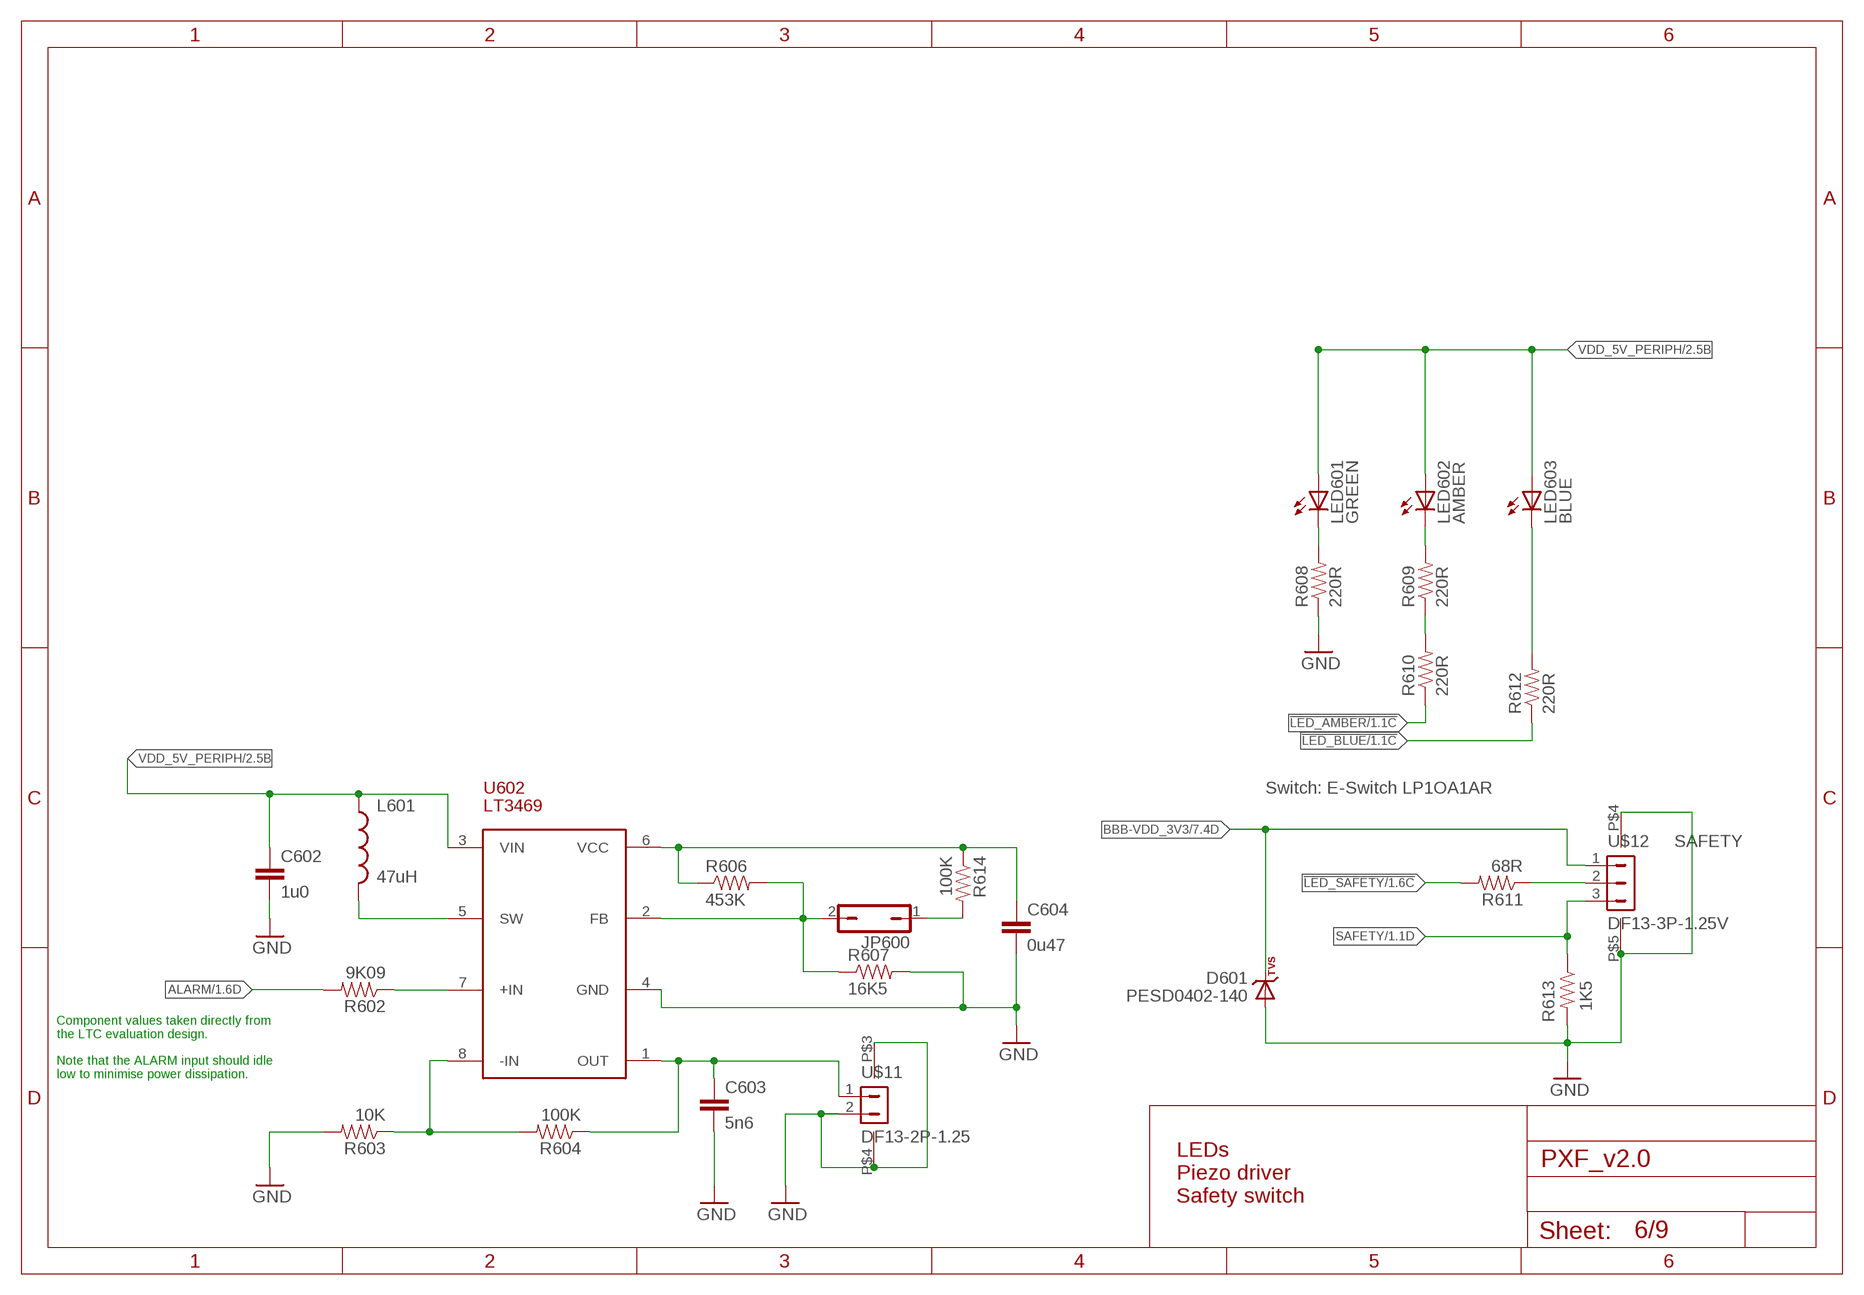
[diagram p5: schematic, sheet 6]

### Parts
C602  1u0  CAP0603  [0603-CAP]
C603  5n6  CAP0402  [0402-CAP]
C604  0u47  CAP0402  [0402-CAP]
D601  PESD0402-140  DIODE-TVS  [0402-TVS]
JP600  JP1Q  [JP1]
L601  47uH  INDUCTOR0805  [0805-IND]
LED601  GREEN  LED0603  [0603-LED]
LED602  AMBER  LED0603  [0603-LED]
LED603  BLUE  LED0603  [0603-LED]
R602  9K09  RESISTOR0402-RES  [0402-RES]
R603  10K  RESISTOR0402-RES  [0402-RES]
R604  100K  RESISTOR0402-RES  [0402-RES]
R606  453K  RESISTOR0402-RES  [0402-RES]
R607  16K5  RESISTOR0402-RES  [0402-RES]
R608  220R  RESISTOR0402-RES  [0402-RES]
R609  220R  RESISTOR0402-RES  [0402-RES]
R610  220R  RESISTOR0402-RES  [0402-RES]
R611  68R  RESISTOR0402-RES  [0402-RES]
R612  220R  RESISTOR0402-RES  [0402-RES]
R613  1K5  RESISTOR0402-RES  [0402-RES]
R614  100K  RESISTOR0402-RES  [0402-RES]
U602  LT3469  [SOT23-8]
U$11  DF13-2P-1.25  [DF13C-2P-1.25V]
U$12  DF13-3P-1.25V  [DF13C-3P-1.25V]

### Nets
!LED_AMBER: R610.P$1 ; also sheet 1,2
!LED_BLUE: R612.P$1 ; also sheet 1,2
!LED_SAFETY: R611.P$2 ; also sheet 1,2
ALARM: R602.P$2 ; also sheet 1,2
BBB-VDD_3V3 [power]: D601.C U$12.1 ; also sheet 2,3,5,7,9
GND [power]: C602.P$2 C603.P$2 C604.P$2 D601.A R603.P$2 R607.P$2 R608.P$1 R613.P$2 U602.4(GND) U$11.2 U$11.P$3 U$11.P$4 U$12.P$4 U$12.P$5 ; also sheet 1,2,3,4,5,7,8,9
N$9: LED603.C R612.P$2
N$24: JP600.2 R606.P$2 R607.P$1 U602.2(FB)
N$25: R603.P$1 R604.P$2 U602.8(-IN)
N$27: C603.P$1 R604.P$1 U602.1(OUT) U$11.1
N$28: R602.P$1 U602.7(+IN)
N$29: LED601.C R608.P$2
N$32: L601.P$2 U602.5(SW)
N$36: C604.P$1 R606.P$1 R614.P$1 U602.6(VCC)
N$39: R609.P$1 R610.P$2
N$40: LED602.C R609.P$2
N$56: JP600.1 R614.P$2
N$57: R611.P$1 U$12.2
SAFETY: R613.P$1 U$12.3 ; also sheet 1
VDD_5V_PERIPH [power]: C602.P$1 L601.P$1 LED601.A LED602.A LED603.A U602.3(VIN) ; also sheet 2,3,5

### Notes on the sheet
- Switch: E-Switch LP1OA1AR
- SAFETY
- Component values taken directly from
  the LTC evaluation design.
  
  Note that the ALARM input should idle
  low to minimise power dissipation.
- LEDs
  Piezo driver
  Safety switch

## Sheet 7 of 9
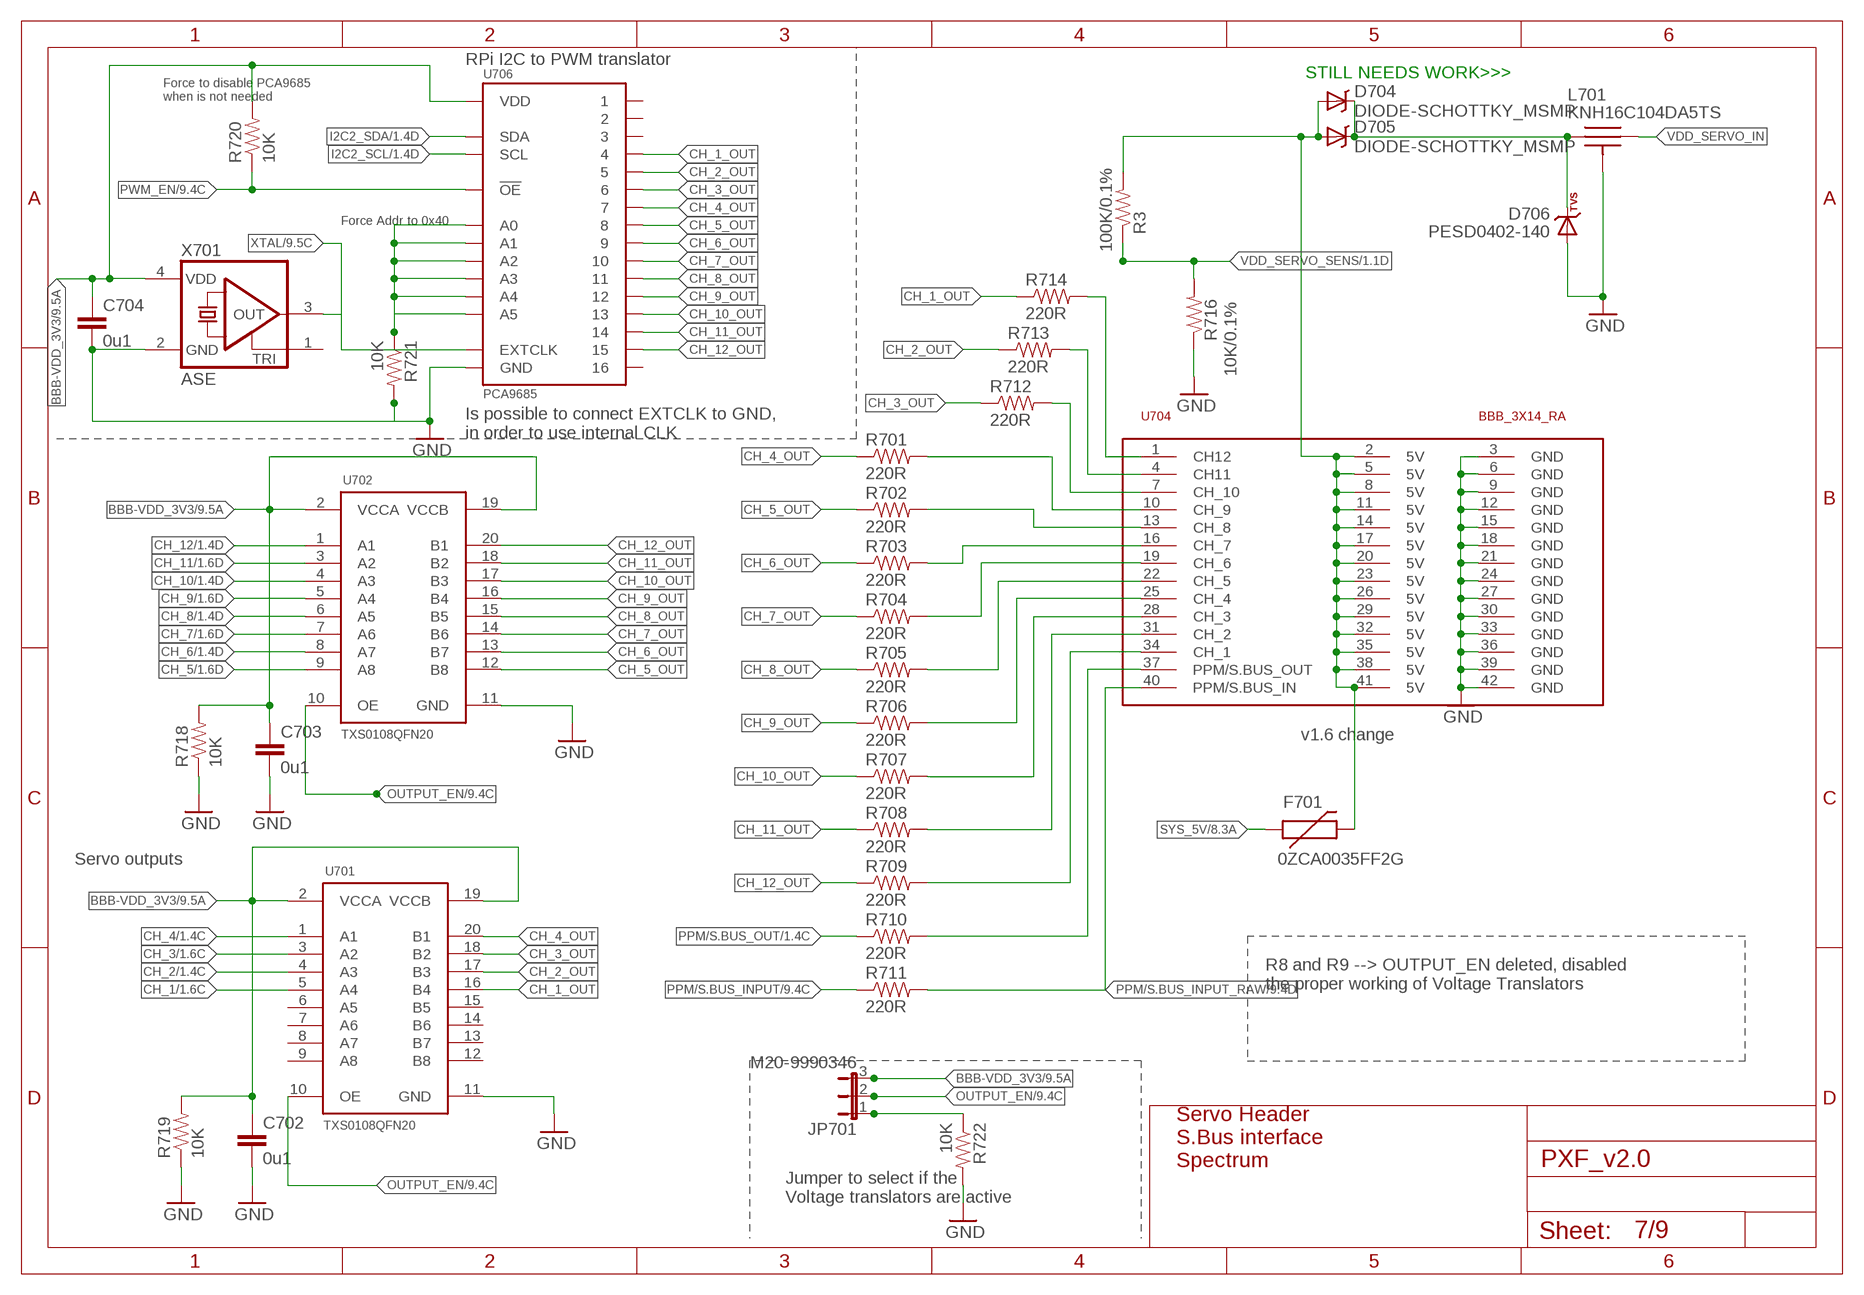
[diagram p6: schematic, sheet 7]

### Parts
C702  0u1  CAP0402  [0402-CAP]
C703  0u1  CAP0402  [0402-CAP]
C704  0u1  CAP0402  [0402-CAP]
D704  DIODE-SCHOTTKY_MSMP  [MICROSMP]
D705  DIODE-SCHOTTKY_MSMP  [MICROSMP]
D706  PESD0402-140  DIODE-TVS  [0402-TVS]
F701  0ZCA0035FF2G  PTCSMD  [PTC-1206]
JP701  M20-9990346  JP2E  [JP2]
L701  KNH16C104DA5TS  [KYOCERA-KNH16-DA]
R3  100K/0.1%  RESISTOR0402-RES  [0402-RES]
R701  220R  RESISTOR0402-RES  [0402-RES]
R702  220R  RESISTOR0402-RES  [0402-RES]
R703  220R  RESISTOR0402-RES  [0402-RES]
R704  220R  RESISTOR0402-RES  [0402-RES]
R705  220R  RESISTOR0402-RES  [0402-RES]
R706  220R  RESISTOR0402-RES  [0402-RES]
R707  220R  RESISTOR0402-RES  [0402-RES]
R708  220R  RESISTOR0402-RES  [0402-RES]
R709  220R  RESISTOR0402-RES  [0402-RES]
R710  220R  RESISTOR0402-RES  [0402-RES]
R711  220R  RESISTOR0402-RES  [0402-RES]
R712  220R  RESISTOR0402-RES  [0402-RES]
R713  220R  RESISTOR0402-RES  [0402-RES]
R714  220R  RESISTOR0402-RES  [0402-RES]
R716  10K/0.1%  RESISTOR0402-RES  [0402-RES]
R718  10K  RESISTOR0402-RES  [0402-RES]
R719  10K  RESISTOR0402-RES  [0402-RES]
R720  10K  RESISTOR0402-RES  [0402-RES]
R721  10K  RESISTOR0402-RES  [0402-RES]
R722  10K  RESISTOR0402-RES  [0402-RES]
U701  TXS0108QFN20  [QFN20-RGY]
U702  TXS0108QFN20  [QFN20-RGY]
U704  BBB_3X14_RA  [3X14RA]
U706  PCA9685  [HVQFN28]
X701  ASE  [ASE]

### Nets
BBB-VDD_3V3 [power]: C702.P$1 C703.P$1 C704.P$1 JP701.3 R718.P$2 R719.P$2 R720.P$2 U701.2(VCCA) U701.19(VCCB) U702.2(VCCA) U702.19(VCCB) U706.25(VDD) X701.4(VDD) ; also sheet 2,3,5,6,9
CH_1: U701.5(A4) ; also sheet 1
CH_1_OUT: R714.P$1 U701.16(B4) U706.6
CH_2: U701.4(A3) ; also sheet 1
CH_2_OUT: R713.P$1 U701.17(B3) U706.7
CH_3: U701.3(A2) ; also sheet 1
CH_3_OUT: R712.P$1 U701.18(B2) U706.8
CH_4: U701.1(A1) ; also sheet 1
CH_4_OUT: R701.P$1 U701.20(B1) U706.9
CH_5: U702.9(A8) ; also sheet 1
CH_5_OUT: R702.P$1 U702.12(B8) U706.10
CH_6: U702.8(A7) ; also sheet 1
CH_6_OUT: R703.P$1 U702.13(B7) U706.12
CH_7: U702.7(A6) ; also sheet 1
CH_7_OUT: R704.P$1 U702.14(B6) U706.13
CH_8: U702.6(A5) ; also sheet 1
CH_8_OUT: R705.P$1 U702.15(B5) U706.14
CH_9: U702.5(A4) ; also sheet 1
CH_9_OUT: R706.P$1 U702.16(B4) U706.15
CH_10: U702.4(A3) ; also sheet 1
CH_10_OUT: R707.P$1 U702.17(B3) U706.16
CH_11: U702.3(A2) ; also sheet 1
CH_11_OUT: R708.P$1 U702.18(B2) U706.17
CH_12: U702.1(A1) ; also sheet 1
CH_12_OUT: R709.P$1 U702.20(B1) U706.18
FMU-CH6-PROT: R708.P$2 U704.31(CH_2)
GND [power]: C702.P$2 C703.P$2 C704.P$2 D706.A L701.P$3 L701.P$4 L701.P$5 R716.P$1 R718.P$1 R719.P$1 R721.P$2 R722.P$2 U701.11(GND) U702.11(GND) U704.3(GND) U704.6(GND) U704.9(GND) U704.12(GND) U704.15(GND) U704.18(GND) U704.21(GND) U704.24(GND) U704.27(GND) U704.30(GND) U704.33(GND) U704.36(GND) U704.39(GND) U704.42(GND) U706.11(GND) U706.PAD(GND) X701.2(GND) ; also sheet 1,2,3,4,5,6,8,9
I2C2_SCL: U706.23(SCL) ; also sheet 1,2,3,4
I2C2_SDA: U706.24(SDA) ; also sheet 1,2,3,4
IO-CH1-PROT: R707.P$2 U704.28(CH_3)
IO-CH8-PROT: R712.P$2 U704.7(CH_10)
N$4 [power]: R721.P$1 U706.1(A3) U706.2(A4) U706.21(A5) U706.26(A0) U706.27(A1) U706.28(A2)
N$10 [power]: D704.CATHODE(C) D705.CATHODE(C) D706.C L701.P$1
N$12: JP701.1 R722.P$1
N$13 [power]: D704.ANODE(A) D705.ANODE(A) F701.2 R3.P$2 U704.2(5V) U704.5(5V) U704.8(5V) U704.11(5V) U704.14(5V) U704.17(5V) U704.20(5V) U704.23(5V) U704.26(5V) U704.29(5V) U704.32(5V) U704.35(5V) U704.38(5V) U704.41(5V)
N$31: R701.P$2 U704.10(CH_9)
N$68: R709.P$2 U704.34(CH_1)
N$71: R702.P$2 U704.13(CH_8)
N$72: R703.P$2 U704.16(CH_7)
N$73: R704.P$2 U704.19(CH_6)
N$74: R705.P$2 U704.22(CH_5)
N$75: R706.P$2 U704.25(CH_4)
N$77: R710.P$2 U704.37(PPM/S.BUS_OUT)
N$99: R713.P$2 U704.4(CH11)
OUTPUT_EN: JP701.2 U701.10(OE) U702.10(OE) ; also sheet 9
PPM-SBUS-PROT: R714.P$2 U704.1(CH12)
PPM/S.BUS_INPUT: R711.P$1 ; also sheet 1,2,9
PPM/S.BUS_INPUT_RAW: R711.P$2 U704.40(PPM/S.BUS_IN) ; also sheet 9
PPM/S.BUS_OUT: R710.P$1 ; also sheet 1
PWM_EN: R720.P$1 U706.20(!OE) ; also sheet 2,9
SYS_5V: F701.1 ; also sheet 1,5,8,9
VDD_SERVO_IN [power]: L701.P$2
VDD_SERVO_SENS: R3.P$1 R716.P$2 ; also sheet 1
XTAL: U706.22(EXTCLK) X701.3(OUT) ; also sheet 9
Unconnected: U701.6(A5) U701.7(A6) U701.8(A7) U701.9(A8) U701.12(B8) U701.13(B7) U701.14(B6) U701.15(B5) U706.3 U706.4 U706.5 U706.19 X701.1(TRI)

### Notes on the sheet
- RPi I2C to PWM translator
- STILL NEEDS WORK>>>
- Force to disable PCA9685 
  when is not needed
- Force Addr to 0x40
- Is possible to connect EXTCLK to GND,
  in order to use internal CLK
- v1.6 change
- Servo outputs
- R8 and R9 --> OUTPUT_EN deleted, disabled 
  the proper working of Voltage Translators
- Servo Header
  S.Bus interface
  Spectrum
- Jumper to select if the 
  Voltage translators are active

## Sheet 8 of 9
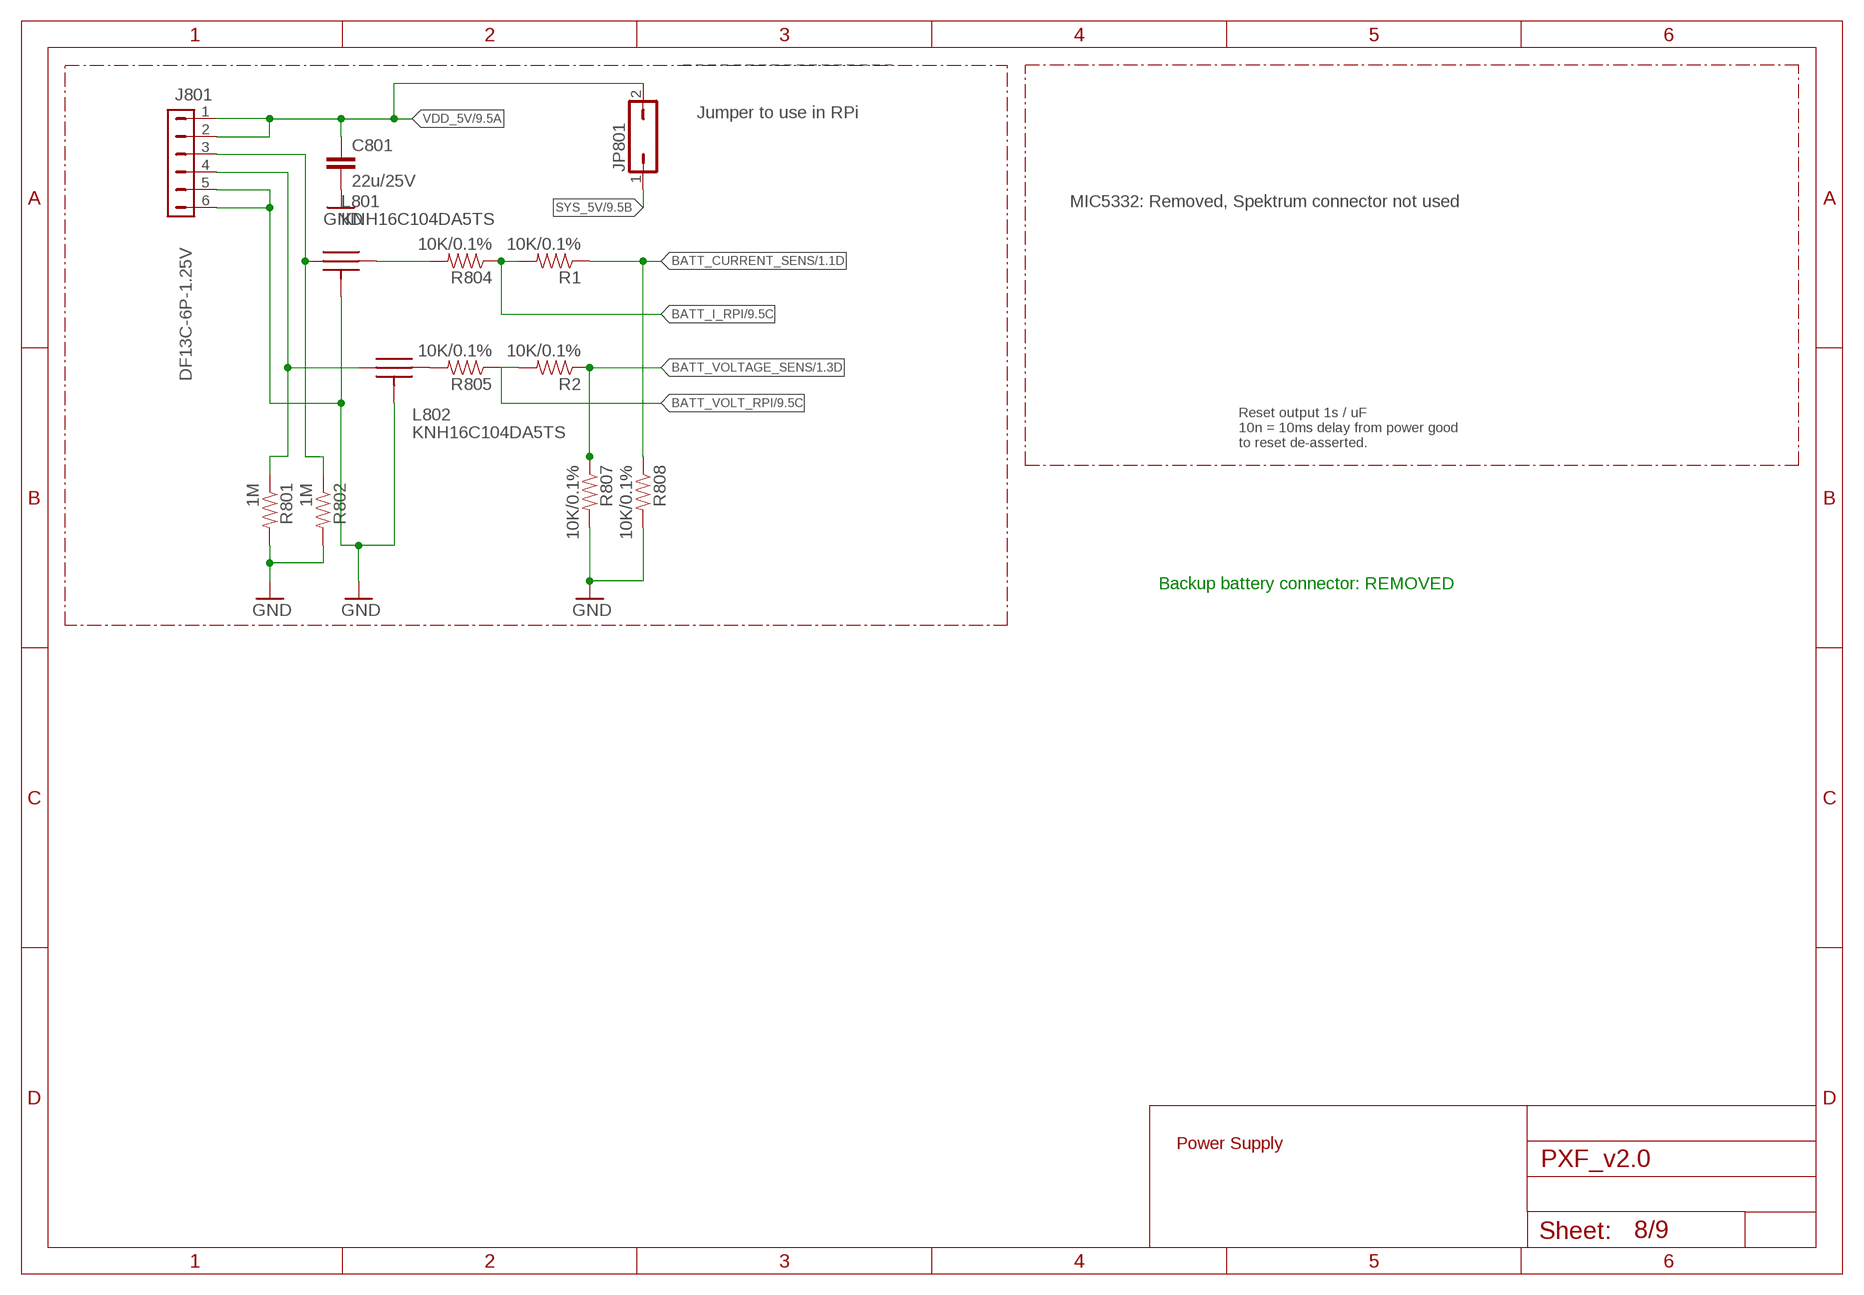
[diagram p7: schematic, sheet 8]

### Parts
C801  22u/25V  CAP0805  [0805-CAP]
J801  DF13C-6P-1.25V  DF13-6P-1.25V  [DF13C-6P-1.25V]
JP801  JP1Q  [JP1]
L801  KNH16C104DA5TS  [KYOCERA-KNH16-DA]
L802  KNH16C104DA5TS  [KYOCERA-KNH16-DA]
R1  10K/0.1%  RESISTOR0402-RES  [0402-RES]
R2  10K/0.1%  RESISTOR0402-RES  [0402-RES]
R801  1M  RESISTOR0402-RES  [0402-RES]
R802  1M  RESISTOR0402-RES  [0402-RES]
R804  10K/0.1%  RESISTOR0402-RES  [0402-RES]
R805  10K/0.1%  RESISTOR0402-RES  [0402-RES]
R807  10K/0.1%  RESISTOR0402-RES  [0402-RES]
R808  10K/0.1%  RESISTOR0402-RES  [0402-RES]

### Nets
BATT_CURRENT_SENS: R1.P$1 R808.P$1 ; also sheet 1
BATT_CURRENT_SENS_PROT: J801.3 L801.P$1 R802.P$1
BATT_I_RPI: R1.P$2 R804.P$1 ; also sheet 4,9
BATT_VOLT_RPI: R2.P$2 R805.P$1 ; also sheet 4,9
BATT_VOLTAGE_SENS: R2.P$1 R807.P$1 ; also sheet 1
BATT_VOLTAGE_SENS_PROT: J801.4 L802.P$1 R801.P$1 ; also sheet 1
GND [power]: C801.P$2 J801.5 J801.6 L801.P$3 L801.P$4 L801.P$5 L802.P$3 L802.P$4 L802.P$5 R801.P$2 R802.P$2 R807.P$2 R808.P$2 ; also sheet 1,2,3,4,5,6,7,9
N$102: L802.P$2 R805.P$2
N$103: L801.P$2 R804.P$2
SYS_5V: JP801.1 ; also sheet 1,5,7,9
VDD_5V [power]: C801.P$1 J801.1 J801.2 JP801.2 ; also sheet 1,2,9

### Notes on the sheet
- Jumper to use in RPi
- MIC5332: Removed, Spektrum connector not used
- Reset output 1s / uF
  10n = 10ms delay from power good
  to reset de-asserted.
- Backup battery connector: REMOVED
- Power Supply

## Sheet 9 of 9
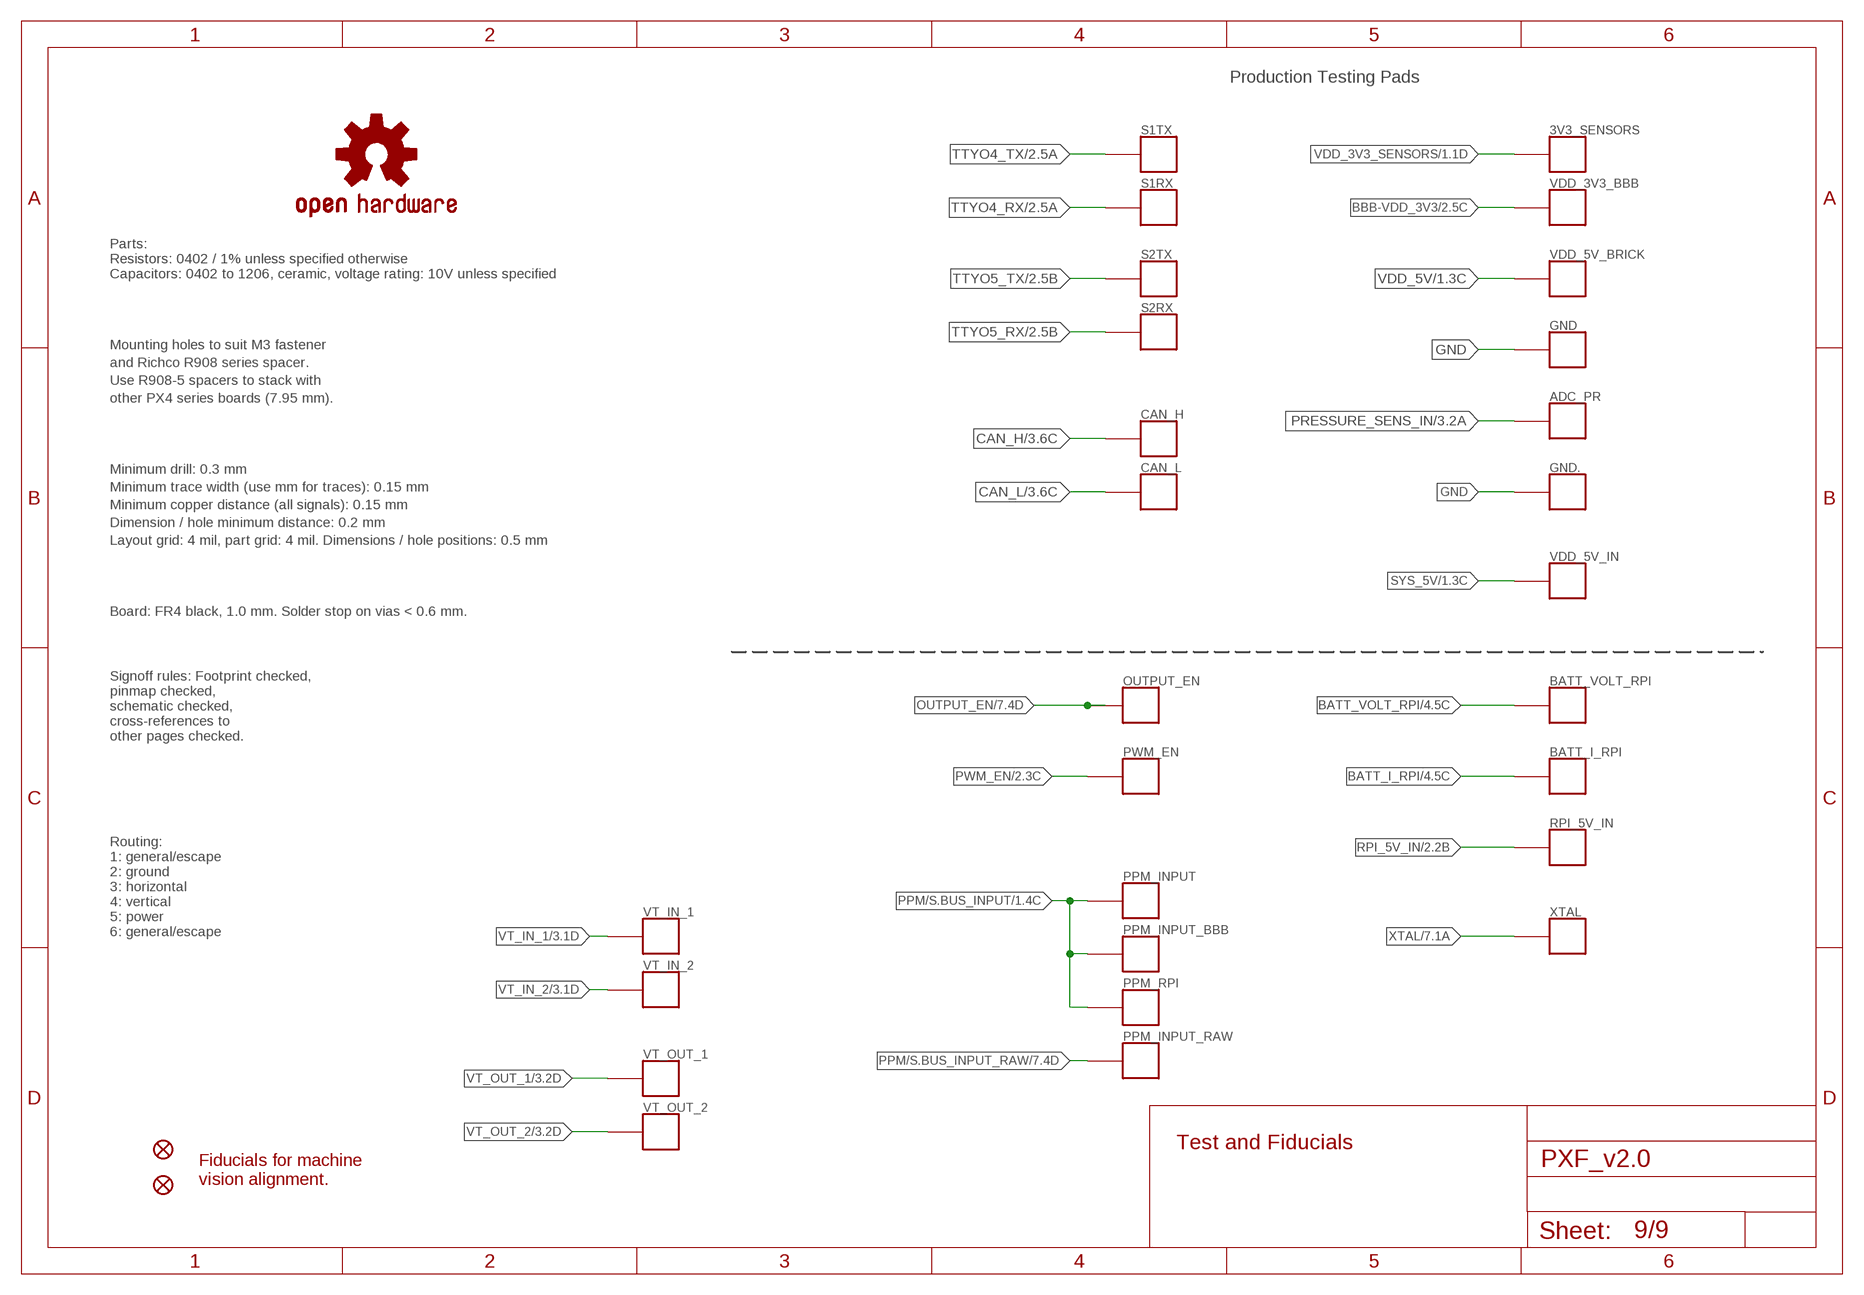
[diagram p8: schematic, sheet 9]

### Parts
3V3_SENSORS  PAD.04  [PAD.04X.04]
ADC_PR  PAD.04  [PAD.04X.04]
BATT_I_RPI  PAD.04  [PAD.04X.04]
BATT_VOLT_RPI  PAD.04  [PAD.04X.04]
CAN_H  PAD.04  [PAD.04X.04]
CAN_L  PAD.04  [PAD.04X.04]
GND  PAD.04  [PAD.04X.04]
GND.  PAD.04  [PAD.04X.04]
JP901  FIDUCIAL1.5X3  [FIDUCIAL-1.5X3]
JP902  FIDUCIAL1.5X3  [FIDUCIAL-1.5X3]
OSHW_LOGO  OSHW-LOGOS  [OSHW-LOGO-S]
OUTPUT_EN  PAD.04  [PAD.04X.04]
PPM_INPUT  PAD.04  [PAD.04X.04]
PPM_INPUT_BBB  PAD.04  [PAD.04X.04]
PPM_INPUT_RAW  PAD.04  [PAD.04X.04]
PPM_RPI  PAD.04  [PAD.04X.04]
PWM_EN  PAD.04  [PAD.04X.04]
RPI_5V_IN  PAD.04  [PAD.04X.04]
S1RX  PAD.04  [PAD.04X.04]
S1TX  PAD.04  [PAD.04X.04]
S2RX  PAD.04  [PAD.04X.04]
S2TX  PAD.04  [PAD.04X.04]
VDD_3V3_BBB  PAD.04  [PAD.04X.04]
VDD_5V_BRICK  PAD.04  [PAD.04X.04]
VDD_5V_IN  PAD.04  [PAD.04X.04]
VT_IN_1  PAD.04  [PAD.04X.04]
VT_IN_2  PAD.04  [PAD.04X.04]
VT_OUT_1  PAD.04  [PAD.04X.04]
VT_OUT_2  PAD.04  [PAD.04X.04]
XTAL  PAD.04  [PAD.04X.04]

### Nets
BATT_I_RPI: BATT_I_RPI.P$1 ; also sheet 4,8
BATT_VOLT_RPI: BATT_VOLT_RPI.P$1 ; also sheet 4,8
BBB-VDD_3V3 [power]: VDD_3V3_BBB.P$1 ; also sheet 2,3,5,6,7
CAN_H: CAN_H.P$1 ; also sheet 3
CAN_L: CAN_L.P$1 ; also sheet 3
GND [power]: GND..P$1 GND.P$1 ; also sheet 1,2,3,4,5,6,7,8
OUTPUT_EN: OUTPUT_EN.P$1 ; also sheet 7
PPM/S.BUS_INPUT: PPM_INPUT.P$1 PPM_INPUT_BBB.P$1 PPM_RPI.P$1 ; also sheet 1,2,7
PPM/S.BUS_INPUT_RAW: PPM_INPUT_RAW.P$1 ; also sheet 7
PRESSURE_SENS_IN: ADC_PR.P$1 ; also sheet 3
PWM_EN: PWM_EN.P$1 ; also sheet 2,7
RPI_5V_IN: RPI_5V_IN.P$1 ; also sheet 2
SYS_5V: VDD_5V_IN.P$1 ; also sheet 1,5,7,8
TTYO4_RX: S1RX.P$1 ; also sheet 2
TTYO4_TX: S1TX.P$1 ; also sheet 2
TTYO5_RX: S2RX.P$1 ; also sheet 2
TTYO5_TX: S2TX.P$1 ; also sheet 2
VDD_3V3_SENSORS [power]: 3V3_SENSORS.P$1 ; also sheet 1,3,4,5
VDD_5V [power]: VDD_5V_BRICK.P$1 ; also sheet 1,2,8
VT_IN_1: VT_IN_1.P$1 ; also sheet 3
VT_IN_2: VT_IN_2.P$1 ; also sheet 3
VT_OUT_1: VT_OUT_1.P$1 ; also sheet 3
VT_OUT_2: VT_OUT_2.P$1 ; also sheet 3
XTAL: XTAL.P$1 ; also sheet 7

### Notes on the sheet
- Production Testing Pads
- Parts:
  Resistors: 0402 / 1% unless specified otherwise
  Capacitors: 0402 to 1206, ceramic, voltage rating: 10V unless specified
- Mounting holes to suit M3 fastener
- and Richco R908 series spacer.
- Use R908-5 spacers to stack with
- other PX4 series boards (7.95 mm).
- Minimum drill: 0.3 mm
- Minimum trace width (use mm for traces): 0.15 mm
- Minimum copper distance (all signals): 0.15 mm
- Dimension / hole minimum distance: 0.2 mm
- Layout grid: 4 mil, part grid: 4 mil. Dimensions / hole positions: 0.5 mm
- Board: FR4 black, 1.0 mm. Solder stop on vias < 0.6 mm.
- Signoff rules: Footprint checked,
  pinmap checked,
  schematic checked, 
  cross-references to
  other pages checked.
- Routing:
  1: general/escape
  2: ground
  3: horizontal
  4: vertical
  5: power
  6: general/escape
- Test and Fiducials
- Fiducials for machine
  vision alignment.

## Power pins joined to a net without a drawn wire
GND: X2.6(GND)
VDD_3V3EXP: U$101.49(VDD_3V3EXP) U$101.50(VDD_3V3EXP)

## Library data of the parts
3V3_SENSORS ADC_PR BATT_I_RPI BATT_VOLT_RPI CAN_H CAN_L GND GND. OUTPUT_EN PPM_INPUT PPM_INPUT_BBB PPM_INPUT_RAW PPM_RPI PWM_EN RPI_5V_IN S1RX S1TX S2RX S2TX VDD_3V3_BBB VDD_5V_BRICK VDD_5V_IN VT_IN_1 VT_IN_2 VT_OUT_1 VT_OUT_2 XTAL = pixhawk2:PAD: Test pad This footprint includes three classes: The actual test pads, a pogo-pin footprint to mount the pogo-pin as through-hole part and a hole footprint which allows the head of the pogo-pin to pass through (do NOT use the hole to mount the pogo-pin). In a typical test setup, the stack would consist of three PCBs: The actual PCB under testing with a test pad on the bottom, then a second PCB with the hole for the pogo-pin head where the PCB under testing is pressed on and a third PCB at 30 mm / 1.2" distance with the pogo-pin footprints. The pogo-pins are soldered to the last PCB. To create the stack, copy the board under testing and exchange the footprints - this way the correct positioning is ensured.; BOM: EXCLUDE; PARTNO: *
C101 C201 C202 C301 C302 C304 C305 C401 C403-C405 C415 C501 C506 C508 C702-C704 = pixhawk2:CAP: Capacitor Standard 0603 ceramic capacitor, and 0.1" leaded capacitor.; PARTNO: CC0402ZRY5V7BB104
C303 = pixhawk2:CAP: Capacitor Standard 0603 ceramic capacitor, and 0.1" leaded capacitor.; PARTNO: CC0805ZKY5V6BB106
C410 = pixhawk2:CAP: Capacitor Standard 0603 ceramic capacitor, and 0.1" leaded capacitor.; PARTNO: C0603C103J5RAC7411
C411 C503 = pixhawk2:CAP: Capacitor Standard 0603 ceramic capacitor, and 0.1" leaded capacitor.; PARTNO: C1608X6S1C225K080AC
C413 = pixhawk2:CAP: Capacitor Standard 0603 ceramic capacitor, and 0.1" leaded capacitor.; BOM: EXCLUDE
C502 = pixhawk2:CAP: Capacitor Standard 0603 ceramic capacitor, and 0.1" leaded capacitor.; PARTNO: C1608X7S0J106M080AC
C504 C510 = pixhawk2:CAP: Capacitor Standard 0603 ceramic capacitor, and 0.1" leaded capacitor.; PARTNO: C3216X5R1A107M160AC
C505 C602 = pixhawk2:CAP: Capacitor Standard 0603 ceramic capacitor, and 0.1" leaded capacitor.; PARTNO: CC0603ZRY5V7BB105
C507 C509 = pixhawk2:CAP: Capacitor Standard 0603 ceramic capacitor, and 0.1" leaded capacitor.; PARTNO: CC0805MKX5R5BB226
C603 = pixhawk2:CAP: Capacitor Standard 0603 ceramic capacitor, and 0.1" leaded capacitor.; PARTNO: CC0402KRX7R7BB562
C604 = pixhawk2:CAP: Capacitor Standard 0603 ceramic capacitor, and 0.1" leaded capacitor.; PARTNO: C1005X5R1C474K050BC
C801 = pixhawk2:CAP: Capacitor Standard 0603 ceramic capacitor, and 0.1" leaded capacitor.; PARTNO: CL21A226MAQNNNE
D201 D202 D301-D303 D601 D706 = pixhawk2:DIODE-TVS; PARTNO: PESD0402-140
D704 D705 = pixhawk2:DIODE-SCHOTTKY: Schottky barrier diode in DO214AC, e.g. Fairchild SS14.; PARTNO: SS14
F701 = pixhawk2:PTC: Resettable Fuse PTC Resettable Fuse. Spark Fun Electronics SKU : COM-08357; PARTNO: 0ZCA0035FF2G
J305 U$12 = pxf:DF13-3P-1.25: DF13-3P 1.25mm Pitch Miniature Crimping Connector.; PARTNO: DF13C-3P-1.25V(20)
J306-J308 J310 J314 = pxf:DF13-4P-1.25: DF13-4P 1.25mm Pitch Miniature Crimping Connector.; PARTNO: DF13C-4P-1.25V(20)
J309 = pxf:DF13-5P-1.25: DF13-5P 1.25mm Pitch Miniature Crimping Connector.; PARTNO: DF13C-5P-1.25V(20)
J801 = con-hirose-df13:DF13-6P-1.25: DF13-6P 1.25mm Pitch Miniature Crimping Connector.; PARTNO: DF13C-6P-1.25V(20)
JP301 JP600 JP801 = jumper:JP1Q: JUMPER; PARTNO: 1-87215-0
JP701 = jumper:JP2E: JUMPER
JP901 JP902 = pixhawk2:FIDUCIAL: Fiducial Alignment Points Various fiducial points for machine vision alignment.; BOM: EXCLUDE; PARTNO: *
L201 L202 L301-L303 L501 L701 L801 L802 = pixhawk2:KNH16C104DA5TS: Kyocera KNH16C104DA5TS EMI filter; PARTNO: KNH16C104DA5TS
L601 = pixhawk2:INDUCTOR: Inductors Basic Inductor/Choke - 0603 and 1210. Footprints are not proven and vary greatly between part numbers. SRR1210: Bourns SRR1210 parts, e.g. SRR1210-100M; PARTNO: MLZ2012M470W
LED601 = pixhawk2:LED: LEDs Standard schematic elements and footprints for 5mm, 3mm, 1206, and 0603 sized LEDs. 5mm - Spark Fun Electronics SKU : COM-00529 (and others); PARTNO: APTD1608CGCK
LED602 = pixhawk2:LED: LEDs Standard schematic elements and footprints for 5mm, 3mm, 1206, and 0603 sized LEDs. 5mm - Spark Fun Electronics SKU : COM-00529 (and others); PARTNO: APTD1608SECK
LED603 = pixhawk2:LED: LEDs Standard schematic elements and footprints for 5mm, 3mm, 1206, and 0603 sized LEDs. 5mm - Spark Fun Electronics SKU : COM-00529 (and others); PARTNO: APTD1608QBC/D
OSHW_LOGO = pixhawk2:OSHW-LOGO: Open Source Hardware Logo This logo indicates the piece of hardware it is found on incorporates a OSHW license and/or adheres to the definition of open source hardware found here: http://freedomdefined.org/OSHW; BOM: EXCLUDE; PARTNO: *
Q501 = transistor-pnp:MMBT3906*: PNP Transistror; PARTNO: MMBT3906LT1G
R1 R2 R4-R7 R215 R303 R306-R308 R310 R311 R314 R506 R508 R509 R603 R716 R718-R722 R804 R805 R807 R808 = pixhawk2:RESISTOR: Resistor Basic schematic elements and footprints for 0603, 1206, and PTH 1/10th watt (small) resistors.; PARTNO: ERA-2AEB103X
R3 = pixhawk2:RESISTOR: Resistor Basic schematic elements and footprints for 0603, 1206, and PTH 1/10th watt (small) resistors.; PARTNO: ERA-2AEB104X
R102 = pixhawk2:RESISTOR: Resistor Basic schematic elements and footprints for 0603, 1206, and PTH 1/10th watt (small) resistors.; PARTNO: RC0402FR-0710ML
R103 = pixhawk2:RESISTOR: Resistor Basic schematic elements and footprints for 0603, 1206, and PTH 1/10th watt (small) resistors.; PARTNO: RC0402FR-074K75L
R201-R204 R208-R211 R226 R227 R309 R701-R714 = pixhawk2:RESISTOR: Resistor Basic schematic elements and footprints for 0603, 1206, and PTH 1/10th watt (small) resistors.; PARTNO: RC0402FR-07120RL
R301 R302 R304 R305 R613 = pixhawk2:RESISTOR: Resistor Basic schematic elements and footprints for 0603, 1206, and PTH 1/10th watt (small) resistors.; PARTNO: RC0402FR-071K5L
R312 R313 R608-R610 R612 = pixhawk2:RESISTOR: Resistor Basic schematic elements and footprints for 0603, 1206, and PTH 1/10th watt (small) resistors.; PARTNO: RC0402FR-07220RL
R315 = pixhawk2:RESISTOR: Resistor Basic schematic elements and footprints for 0603, 1206, and PTH 1/10th watt (small) resistors.; PARTNO: RC0402FR-070RL
R501 R607 = pixhawk2:RESISTOR: Resistor Basic schematic elements and footprints for 0603, 1206, and PTH 1/10th watt (small) resistors.; PARTNO: RMCF0402FT16K5
R502 R507 = pixhawk2:RESISTOR: Resistor Basic schematic elements and footprints for 0603, 1206, and PTH 1/10th watt (small) resistors.; PARTNO: MCR01MRTF1004
R503 = pixhawk2:RESISTOR: Resistor Basic schematic elements and footprints for 0603, 1206, and PTH 1/10th watt (small) resistors.; PARTNO: RC0402FR-071K8L
R504 = pixhawk2:RESISTOR: Resistor Basic schematic elements and footprints for 0603, 1206, and PTH 1/10th watt (small) resistors.; PARTNO: RMCF0402FT25K5
R505 = pixhawk2:RESISTOR: Resistor Basic schematic elements and footprints for 0603, 1206, and PTH 1/10th watt (small) resistors.; PARTNO: RC0402FR-0710RL
R602 = pixhawk2:RESISTOR: Resistor Basic schematic elements and footprints for 0603, 1206, and PTH 1/10th watt (small) resistors.; PARTNO: RMCF0402FT9K09
R604 R614 = pixhawk2:RESISTOR: Resistor Basic schematic elements and footprints for 0603, 1206, and PTH 1/10th watt (small) resistors.; PARTNO: RC0402FR-07100KL
R606 = pixhawk2:RESISTOR: Resistor Basic schematic elements and footprints for 0603, 1206, and PTH 1/10th watt (small) resistors.; PARTNO: RMCF0402FT453K
R611 = pixhawk2:RESISTOR: Resistor Basic schematic elements and footprints for 0603, 1206, and PTH 1/10th watt (small) resistors.; PARTNO: RC0402FR-0768RL
R801 R802 = pixhawk2:RESISTOR: Resistor Basic schematic elements and footprints for 0603, 1206, and PTH 1/10th watt (small) resistors.; PARTNO: RC0402FR-071ML
SJ1 = microbuilder:SOLDERJUMPER: SMD Solder JUMPER Solder the two pads together to create a connection, or remove the solder to break it. REFLOW - Use this footprint for solder paste and reflow ovens. WAVE - Use this footprint for hand-soldering (larger pads). CLOSED - Has a trace between the two pads to ensure it is closed by default. The trace needs to be cut to disable the jumper, and can be closed again by creating a solder bridge between the two pads.
U1 = pixhawk2:EEPROM-I2C: I2C EEPROM Generic footprint for I2C EEPROMS. Compatible types include: Microchip 24FC128-I/MS Microchip 24AA256-I/MS ST Microelectronics M24128-BWDW6TP; PARTNO: AT24CS32-SSHM
U2 = pixhawk2:EEPROM-I2C: I2C EEPROM Generic footprint for I2C EEPROMS. Compatible types include: Microchip 24FC128-I/MS Microchip 24AA256-I/MS ST Microelectronics M24128-BWDW6TP; PARTNO: ATSHA204-SH-DA-TTR-ND
U102 = pixhawk2:FM25V01: FM25V01 128Kb Serial 3V F-RAM Memory; DATASHEET: http://www.ramtron.com/files/datasheets/FM25V01_ds.pdf; LINK: http://www.digikey.com/product-detail/en/FM25V01-GTR/1140-1026-1-ND/2809832; MFGPN: FM25V01; PARTNO: FM25V01-G
U201 U302 U701 U702 = pixhawk2:TXS0108; PARTNO: TXS0108ERGYR
U202 = FLYFISH:EEPROM24
U301 = pixhawk2:MAX3051: 3.3-V CAN TRANSCEIVER; PARTNO: MAX3051EKA
U304 = Erle:PCA9603
U401 = pixhawk2:MS5611-01BA: MS5611-01BA The MS5611-01BA is a new generation of high resolution altimeter sensors from MEAS Switzerland with SPI and I 2 C bus interface. It is optimized for altimeters and variometers with an altitude resolution of 10 cm. The sensor module includes a high linearity pressure sensor and an ultra low power 24 bit ?? ADC with internal factory calibrated coefficients. It provides a precise digital 24 Bit pressure and temperature value and different operation modes that allow the user to optimize for conversion speed and current consumption. A high resolution temperature output allows the implementation of an altimeter/thermometer function without any additional sensor. The MS5611-01BA can be interfaced to virtually any microcontroller. The communication protocol is simple, without the need of programming internal registers in the device. Small dimensions of only 5.0 mm x 3.0 mm and a height of 1.7 mm allow for integration in mobile devices. This new sensor module generation is based on leading MEMS technology and latest benefits from MEAS Switzerland proven experience and know-how in high volume manufacturing of altimeter modules, which have been widely used for over a decade. The sensing principle employed leads to very low hysteresis and high stability of both pressure and temperature signal. High resolution module, 10 cm Fast conversion down to 1 ms Low power, 1 µA (standby < 0.15 µA) QFN package 5.0 x 3.0 x 1.7 mm3 Supply voltage 1.8 to 3.6 V Integrated digital pressure sensor (24 bit ?? ADC) Operating range: 10 to 1200 mbar, -40 to +85 °C I2C and SPI interface up to 20 MHz No external components (Internal oscillator) Excellent long term stability; DATASHEET: http://www.meas-spec.com/downloads/MS5611-01BA01.pdf; LINK: http://www.meas-spec.com/product/t_product.aspx?id=8503#; MFGPN: MS5611-01BA; PARTNO: MS5611-01BA
U403 = SparkFun-Sensors:BMP180: BOSCH BMP180 DIGITAL BAROMETRIC PRESSURE SENSOR Web page: http://www.bosch-sensortec.com/en/homepage/products_3/environmental_sensors_1/bmp180_1/bmp180 Datasheet: http://ae-bst.resource.bosch.com/media/products/dokumente/bmp180/BST-BMP180-DS000-09.pdf The BMP180 is the function compatible successor of the BMP085, a new generation of high precision digital pressure sensors for consumer applications. The ultra-low power, low voltage electronics of the BMP180 is optimized for use in mobile phones, PDAs, GPS navigation devices and outdoor equipment. With a low altitude noise of merely 0.25m at fast conversion time, the BMP180 offers superior performance. The I2C interface allows for easy system integration with a microcontroller. The BMP180 is based on piezo-resistive technology for EMC robustness, high accuracy and linearity as well as long term stability. Key features: - Temperature measurement included - I2C interface - Fully calibrated - Pb-free, halogen-free and RoHS compliant, - MSL 1 Basic specs: Pressure range: 300 to 1100hPa (+9000m to -500m relating to sea level) Supply voltage: 1.8 to 3.6V (VDD), 1.62V to 3.6V (VDDIO) Package: LGA package with metal lid Small footprint: 3.6mm x 3.8mm Super-flat: 0.93mm height Low power: 5μA at 1 sample / sec. in standard mode Low noise: 0.06hPa (0.5m) in ultra low power mode, 0.02hPa (0.17m) advanced resolution mode Typical applications: - Enhancement of GPS navigation (dead-reckoning, slope detection, etc.) - In- and out-door navigation - Leisure and sports - Weather forecast - Vertical velocity indication (rise/sink speed)
U404 = microbuilder:ADC_ADS1015: ADS1015 - 12-bit 4-Channel I2C ADC with Internal PGA VDD: 2.0-5.5V Sampling Rate: 3.3ksps Gain Settings: 2/3, 1, 2, 4, 8, 16 I2C Address: ADDR low = 1001000x, ADDR high = 1001001x Internal Comparator The ADS1015 includes an internal comparator that can be set to output a high-level on ALERT when the conversion results exceeeds a pre-defined upper level, and will deassert itself when the level falls below a pre-defined lower threshold level. It can also be set to windowed mode where the ALERT pin will be asserted if the data exceeds the upper threshold or falls below the lower threshold.
U405 = pixhawk2:MPU-6500; PARTNO: MPU-9250
U501 U503 = pixhawk2:BQ24315; PARTNO: BQ24315DSGR
U502 = pixhawk2:MIC5332; PARTNO: MIC5332-SSYMT
U602 = pixhawk2:LT3469: LT3469 Piezo microactuator driver with boost regulator; PARTNO: LT3469ETS8
U704 = pixhawk2:BBB_3X14_RA; PARTNO: 07579
U706 = nxp:PCA9685
U$2 U$201 = pxf:DF13-6P-1.25: DF13-6P 1.25mm Pitch Miniature Crimping Connector.; PARTNO: DF13C-6P-1.25V(20)
U$3 = Erle:P-MOSFET
U$4 = Erle:DMMT5401
U$11 = pxf:DF13-2P-1.25: DF13-2P 1.25mm Pitch Miniature Crimping Connector.; PARTNO: DF13C-2P-1.25V(20)
U$101 = pixhawk2:BEAGLEBONE_OUTLINE: Should match A3 pinout - but not completely tested; BOM: EXCLUDE
X2 = raspberrypi_bastelstube_v13:RASPI_BOARD_B+: Raspberry Pi GPIO connector with markings for the outer dimensions of the Raspberry Pi board model B+ with different sets of drill holes or mounting pads
X701 = crystal:ASE: 3.3Vdc CMOS SMD CRYSTAL CLOCK OSCILLATOR SOurce: www.abracon.com; MPN: ASFL1-24.576MHZ-EC-T; OC_FARNELL: unknown; OC_NEWARK: unknown

## Net classes
0 signal: width 0.127 mm, drill 0.2 mm, clearance 0.127 mm
1 power: width 0.127 mm, drill 0.2 mm, clearance 0.127 mm